# EAGLE design Cypher - V0.3 (EAGLE 9.0.1)
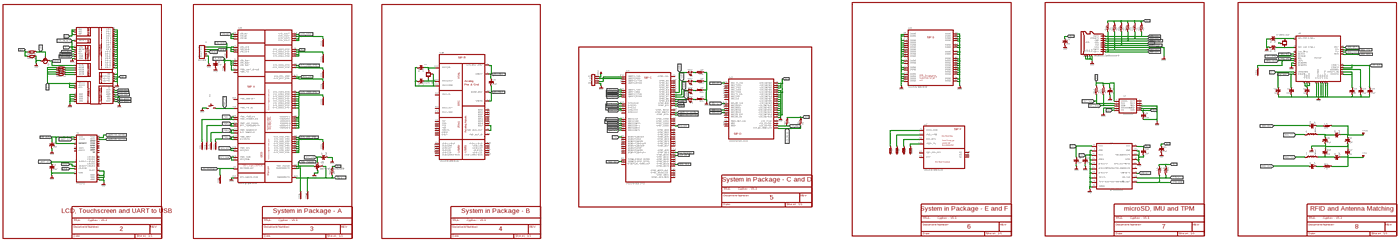
[diagram p0: schematic, sheet 1, overview]
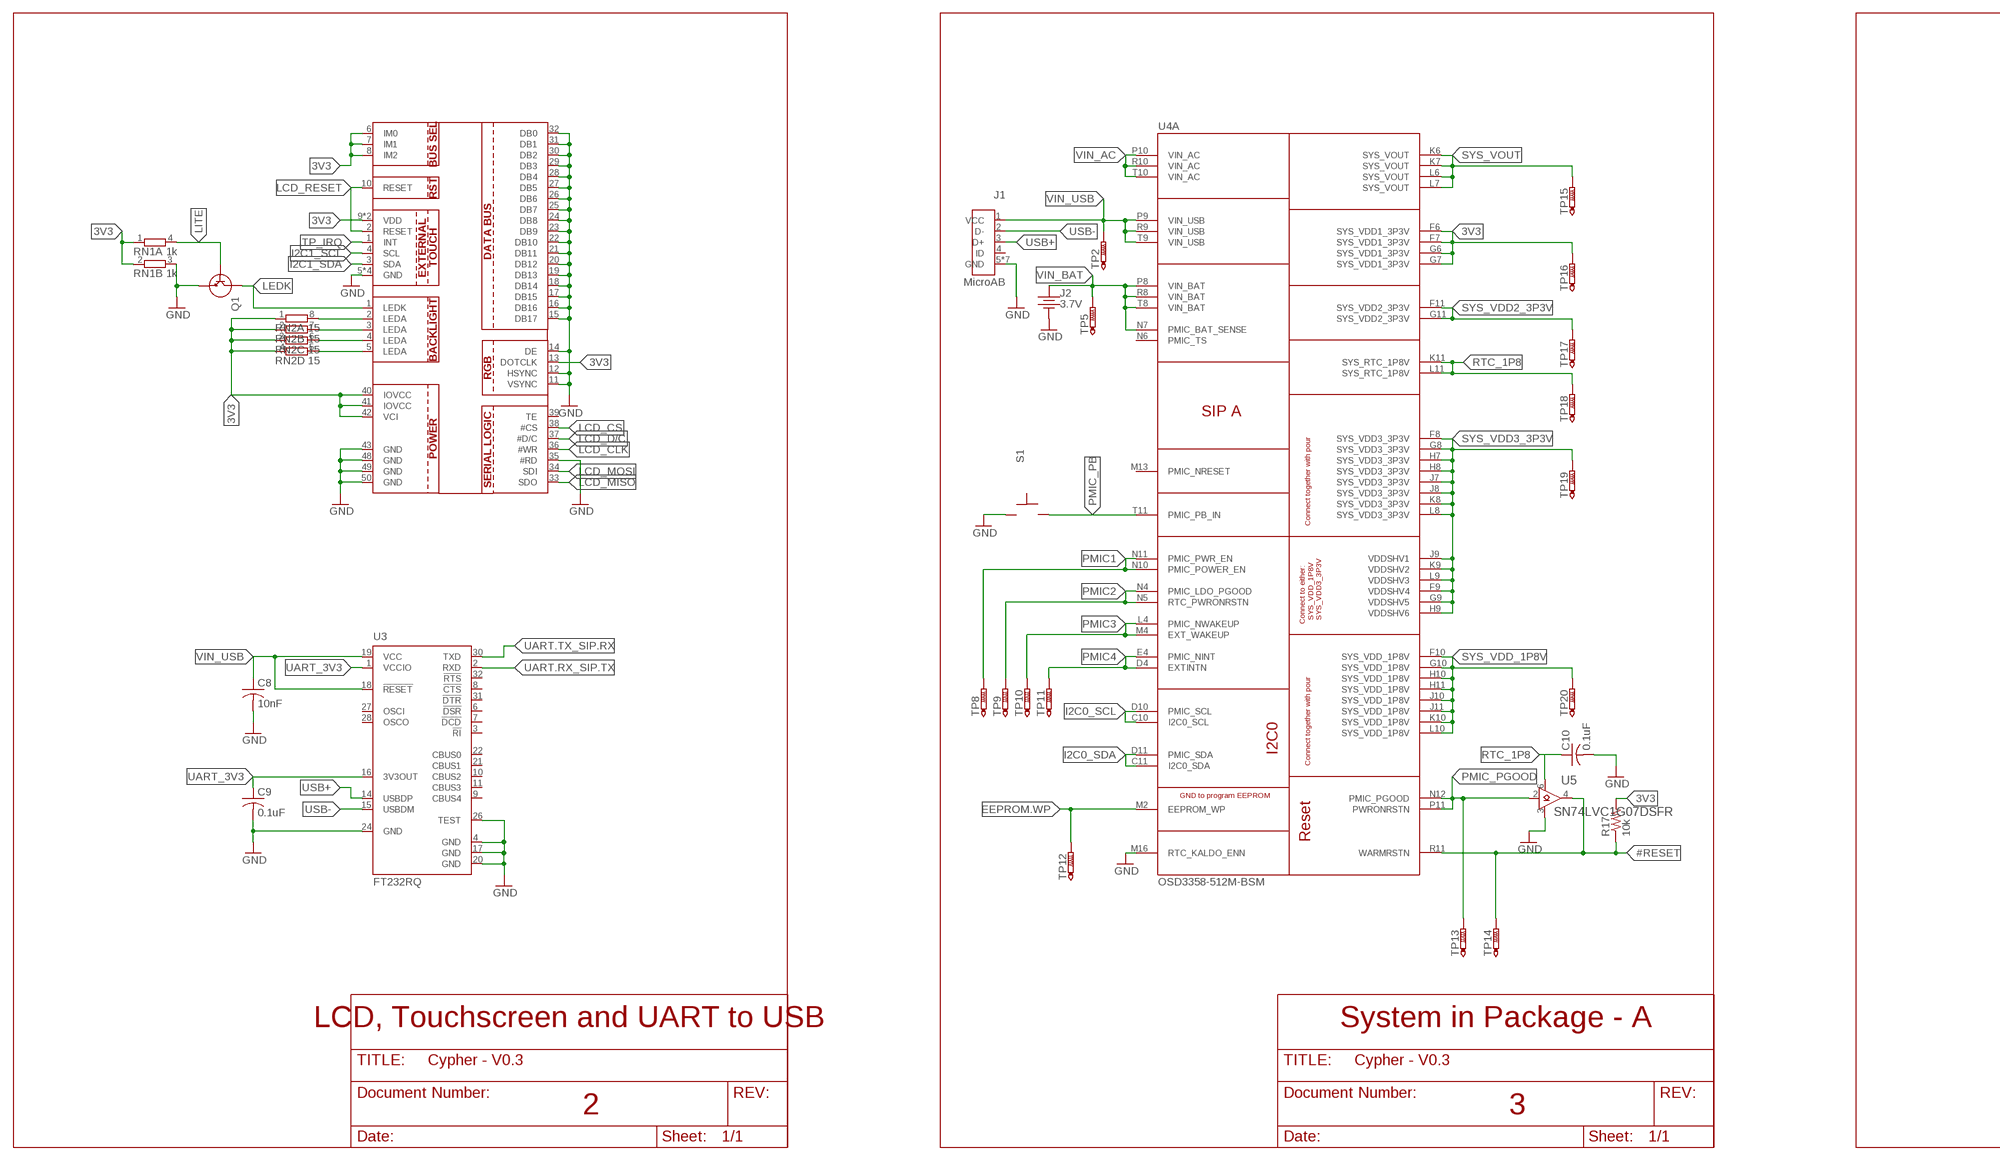
[diagram p1: schematic, sheet 1, part 1 of 4]
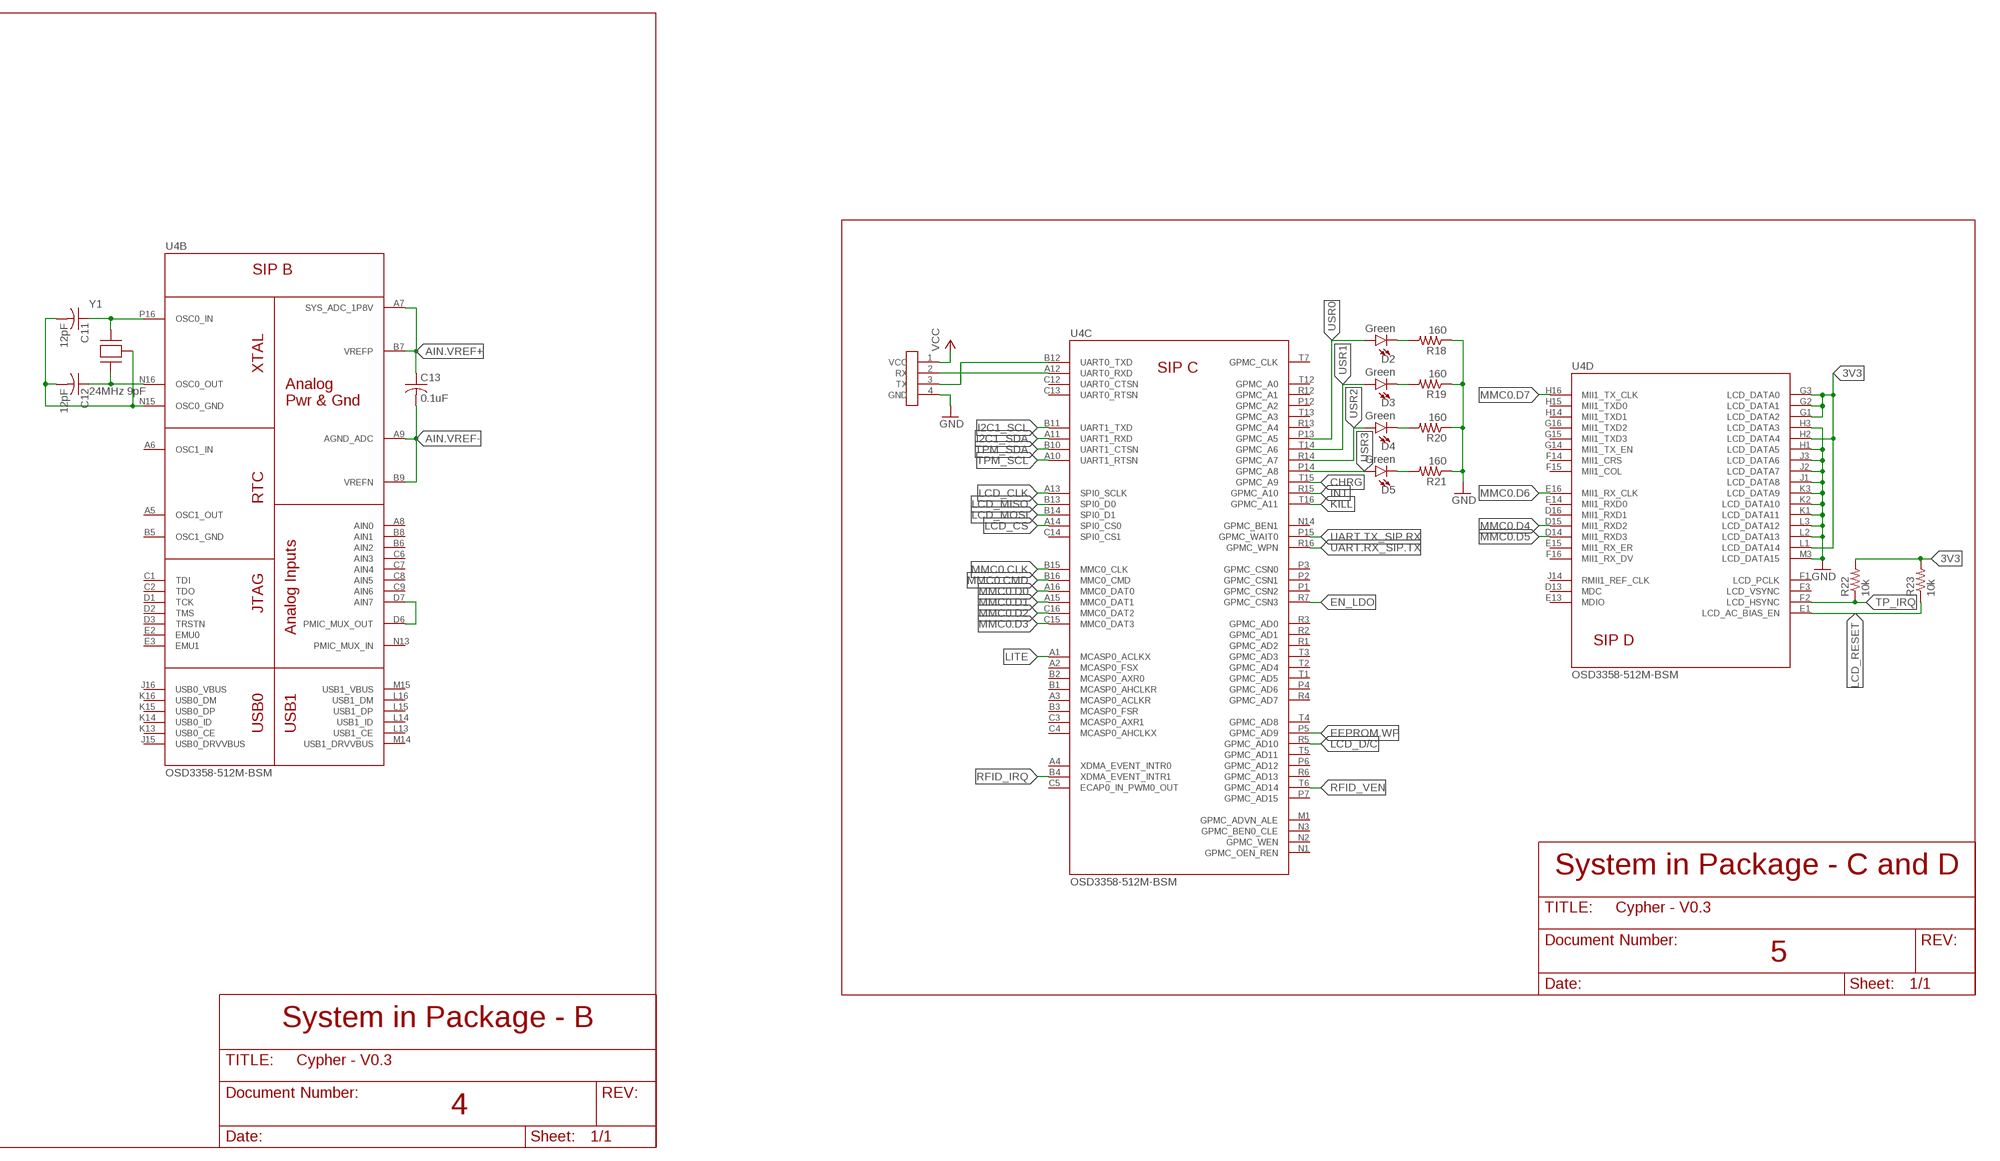
[diagram p2: schematic, sheet 1, part 2 of 4]
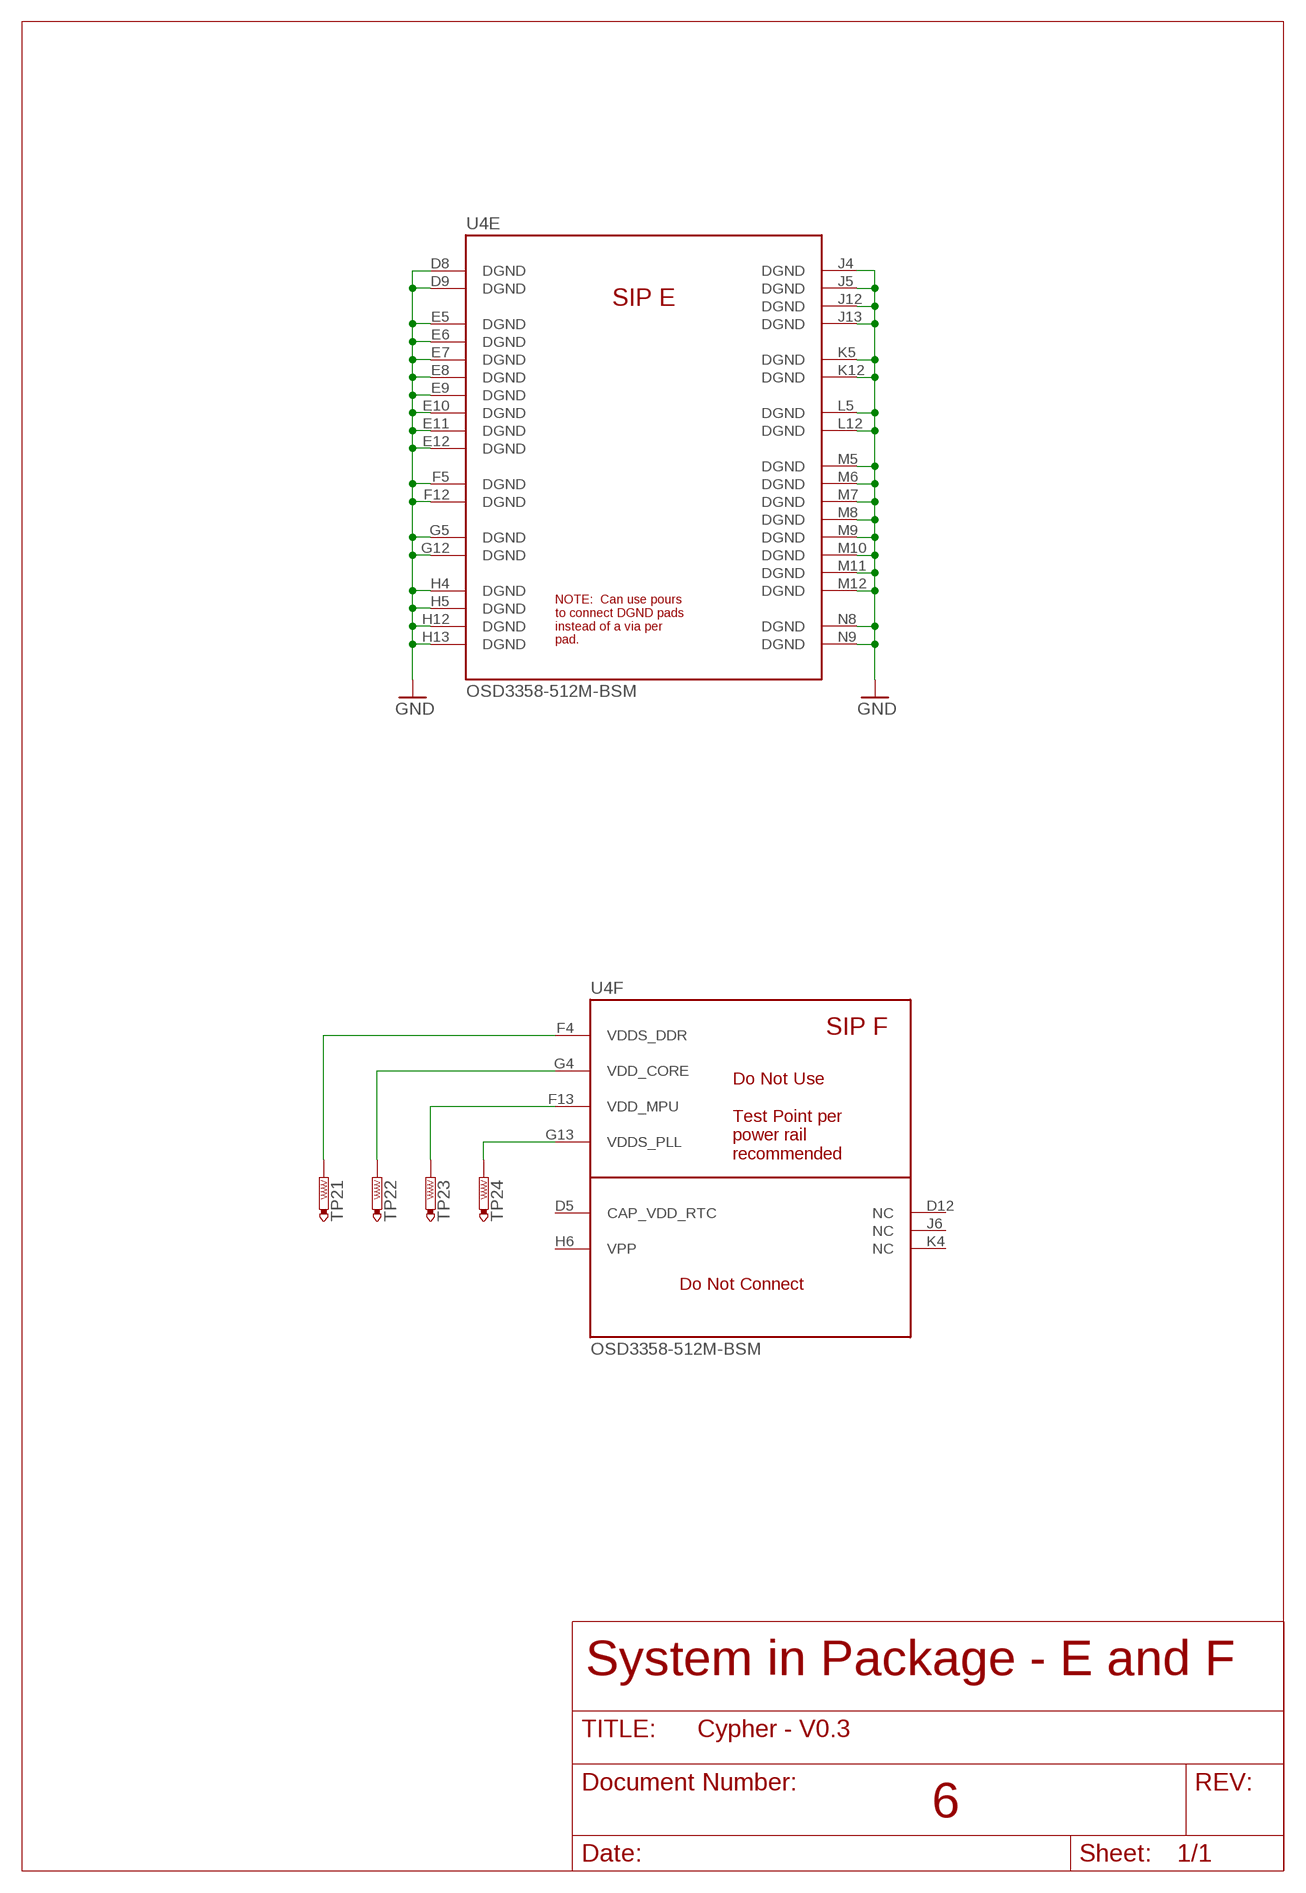
[diagram p3: schematic, sheet 1, part 3 of 4]
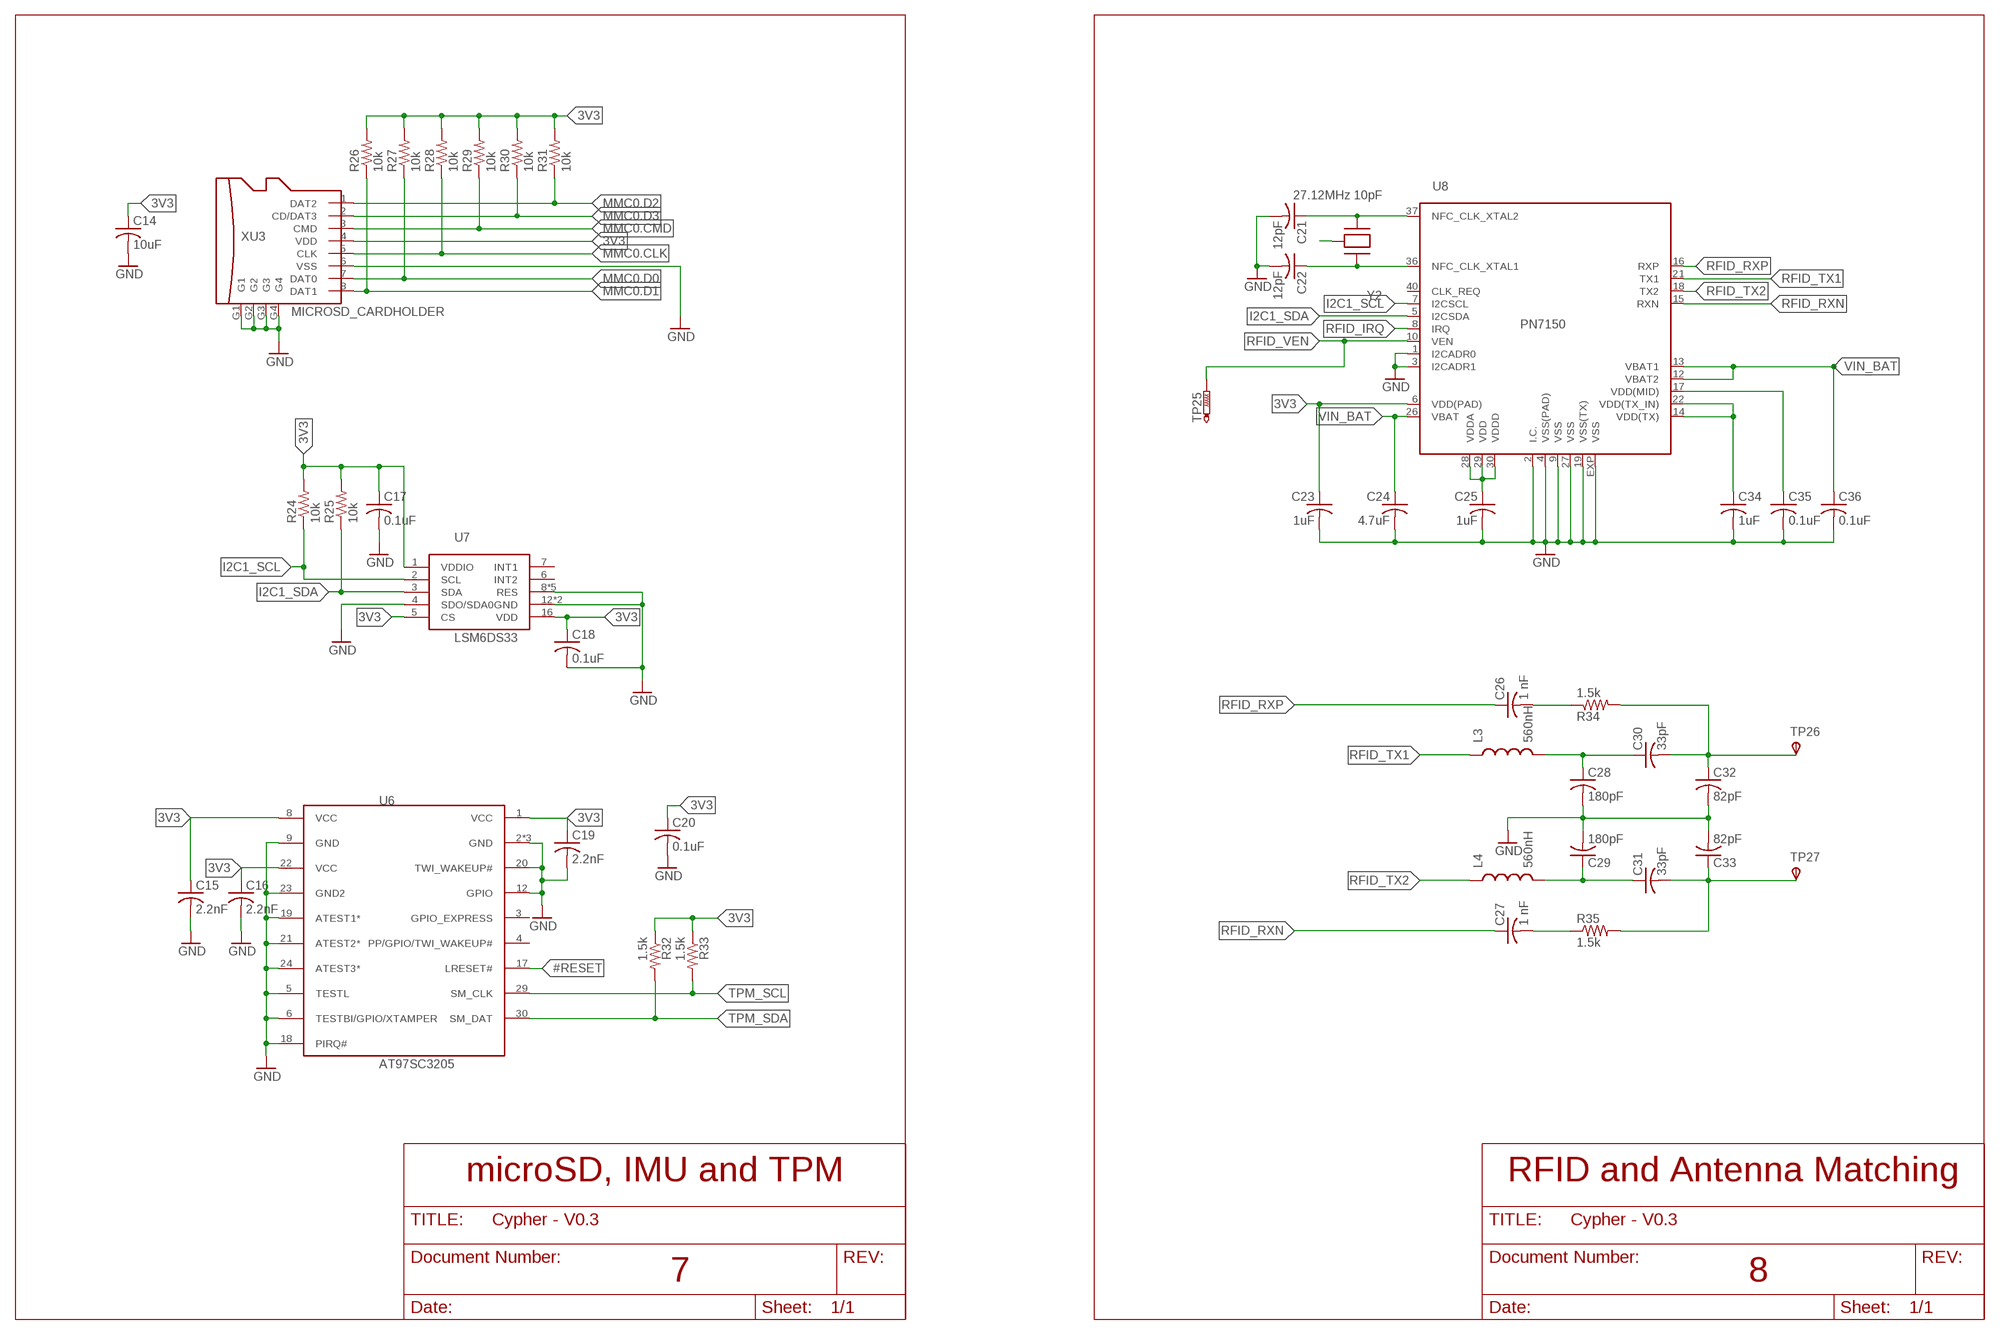
[diagram p4: schematic, sheet 1, part 4 of 4]

## Parts
C8  10nF  C-USC0402  [C0402]
C9  0.1uF  C-USC0402  [C0402]
C10  0.1uF  C-USC0402  [C0402]
C11  12pF  C-USC0402  [C0402]
C12  12pF  C-USC0402  [C0402]
C13  0.1uF  C-USC0402  [C0402]
C14  10uF  C-USC0402  [C0402]
C15  2.2nF  C-USC0402  [C0402]
C16  2.2nF  C-USC0402  [C0402]
C17  0.1uF  C-USC0402  [C0402]
C18  0.1uF  C-USC0402  [C0402]
C19  2.2nF  C-USC0402  [C0402]
C20  0.1uF  C-USC0402  [C0402]
C21  12pF  C-USC0402  [C0402]
C22  12pF  C-USC0402  [C0402]
C23  1uF  C-USC0402  [C0402]
C24  4.7uF  C-USC0402  [C0402]
C25  1uF  C-USC0402  [C0402]
C26  1 nF  C-USC0603  [C0603]
C27  1 nF  C-USC0603  [C0603]
C28  180pF  C-USC0402  [C0402]
C29  180pF  C-USC0402  [C0402]
C30  33pF  C-USC0402  [C0402]
C31  33pF  C-USC0402  [C0402]
C32  82pF  C-USC0402  [C0402]
C33  82pF  C-USC0402  [C0402]
C34  1uF  C-USC0402  [C0402]
C35  0.1uF  C-USC0402  [C0402]
C36  0.1uF  C-USC0402  [C0402]
D2  Green  LED0603  [LED-0603]
D3  Green  LED0603  [LED-0603]
D4  Green  LED0603  [LED-0603]
D5  Green  LED0603  [LED-0603]
J1  MicroAB  MICRO_USB_AB_SMD  [MICRO-USB-AB-SMD]
J2  3.7V  SH-CONNECTOR  [SH_CONNECTOR]
J3  UARTPINSSH  [SM04B-SRSS-TB]
L3  560nH  INDUCTOR0402  [C0402]
L4  560nH  INDUCTOR0402  [C0402]
Q1  MMBT2222ASOT23  [SOT-23-3]
R17  10k  R-US_R0402  [R0402]
R18  160  R-US_R0402  [R0402]
R19  160  R-US_R0402  [R0402]
R20  160  R-US_R0402  [R0402]
R21  160  R-US_R0402  [R0402]
R22  10k  R-US_R0402  [R0402]
R23  10k  R-US_R0402  [R0402]
R24  10k  R-US_R0402  [R0402]
R25  10k  R-US_R0402  [R0402]
R26  10k  R-US_R0402  [R0402]
R27  10k  R-US_R0402  [R0402]
R28  10k  R-US_R0402  [R0402]
R29  10k  R-US_R0402  [R0402]
R30  10k  R-US_R0402  [R0402]
R31  10k  R-US_R0402  [R0402]
R32  1.5k  R-US_R0402  [R0402]
R33  1.5k  R-US_R0402  [R0402]
R34  1.5k  R-US_R0402  [R0402]
R35  1.5k  R-US_R0402  [R0402]
RN1  1k  2R-NEXBV4V  [EXBV4V]
RN2  15  4R-NEXBN8V  [EXBN8V]
S1  PUSHBUTTON1.2  [EVQ-PUK]
TP2  PTR1B1,27  [B1,27]
TP5  PTR1B1,27  [B1,27]
TP8  PTR1B1,27  [B1,27]
TP9  PTR1B1,27  [B1,27]
TP10  PTR1B1,27  [B1,27]
TP11  PTR1B1,27  [B1,27]
TP12  PTR1B1,27  [B1,27]
TP13  PTR1B1,27  [B1,27]
TP14  PTR1B1,27  [B1,27]
TP15  PTR1B1,27  [B1,27]
TP16  PTR1B1,27  [B1,27]
TP17  PTR1B1,27  [B1,27]
TP18  PTR1B1,27  [B1,27]
TP19  PTR1B1,27  [B1,27]
TP20  PTR1B1,27  [B1,27]
TP21  PTR1B1,27  [B1,27]
TP22  PTR1B1,27  [B1,27]
TP23  PTR1B1,27  [B1,27]
TP24  PTR1B1,27  [B1,27]
TP25  PTR1B1,27  [B1,27]
TP26  TPSB2,54  [B2,54]
TP27  TPSB2,54  [B2,54]
U3  FT232RQ  [QFN32]
U4  OSD3358-512M-BSM  [OSD335X-BGA-256]
U5  SN74LVC1G07DSFR  [SON35P100X100X40-6N]
U6  AT97SC3205  [QFN32-4MM]
U7  LSM6DS33  [LGA-16]
U8  PN7150  [HVQFN40]
XU1  CAPTOUCHSCREEN_6PINFPC10PIN  [DF37NB-10DS-0.4V]
XU2  ILI9388_50PIN_SOCKET  [FPC/FFC_50PIN_0.5MMPITCH]
XU3  MICROSD_CARDHOLDER  [HINGED_LID_MICROSD]
Y1  24MHz 9pF  TSX-3225  [4-SMD]
Y2  27.12MHz 10pF  CRISTAL_XRCGB  [XRCGB]

## Nets
3V3: C14.1 C15.1 C16.1 C17.1 C18.1 C19.1 C20.1 C23.1 R17.2 R22.2 R23.2 R24.2 R25.2 R26.2 R27.2 R28.2 R29.2 R30.2 R31.2 R32.1 R33.1 RN1.1 RN1.2 RN2.1 RN2.2 RN2.3 RN2.4 TP16.TP U4.F6(A:SYS_VDD1_3P3V) U4.F7(A:SYS_VDD1_3P3V) U4.G1(D:LCD_DATA2) U4.G2(D:LCD_DATA1) U4.G3(D:LCD_DATA0) U4.G6(A:SYS_VDD1_3P3V) U4.G7(A:SYS_VDD1_3P3V) U4.H2(D:LCD_DATA4) U4.L1(D:LCD_DATA14) U6.1(VCC) U6.8(VCC) U6.22(VCC) U7.1(VDDIO) U7.5(CS) U7.16(VDD) U8.6(VDD(PAD)) XU1.9(VDD) XU1.10(VDD) XU2.6(IM0) XU2.7(IM1) XU2.8(IM2) XU2.13(DOTCLK) XU2.40(IOVCC) XU2.41(IOVCC) XU2.42(VCI) XU3.4(VDD)
#RESET: R17.1 TP14.TP U4.R11(A:WARMRSTN) U5.4(Y) U6.17(LRESET#)
AIN.VREF+: C13.1 U4.A7(B:SYS_ADC_1P8V) U4.B7(B:VREFP)
AIN.VREF-: C13.2 U4.A9(B:AGND_ADC) U4.B9(B:VREFN)
ANT_1: C30.2 C32.1 R34.2 TP26.TP(PP)
ANT_2: C31.2 C33.1 R35.2 TP27.TP(PP)
CHRG: U4.T15(C:GPMC_A9)
D2_CAT: D2.C R18.2
D3_CAT: D3.C R19.2
D4_CAT: D4.C R20.2
D5_CAT: D5.C R21.2
EEPROM.WP: TP12.TP U4.M2(A:EEPROM_WP) U4.P5(C:GPMC_AD9)
EMCF_ANTM1: C28.1 C30.1 L3.2
EMCF_ANTM2: C29.1 C31.1 L4.2
EN_LDO: U4.R7(C:GPMC_CSN3)
GND: C8.2 C9.2 C10.2 C14.2 C15.2 C16.2 C17.2 C18.2 C19.2 C20.2 C21.2 C22.2 C23.2 C24.2 C25.2 C28.2 C29.2 C32.2 C33.2 C34.2 C35.2 C36.2 J1.5(GND) J1.PAD1(GND) J1.PAD2(GND) J1.PAD3(GND) J1.PAD4(GND) J1.PAD5(GND) J1.PAD6(GND) J2.1(V-) J3.4(GND) Q1.E R18.1 R19.1 R20.1 R21.1 RN1.3 S1.2 S1.4 U3.4(GND) U3.17(GND) U3.20(GND) U3.24(GND) U3.26(TEST) U4.D8(E:DGND) U4.D9(E:DGND) U4.E5(E:DGND) U4.E6(E:DGND) U4.E7(E:DGND) U4.E8(E:DGND) U4.E9(E:DGND) U4.E10(E:DGND) U4.E11(E:DGND) U4.E12(E:DGND) U4.F5(E:DGND) U4.F12(E:DGND) U4.G5(E:DGND) U4.G12(E:DGND) U4.H1(D:LCD_DATA5) U4.H3(D:LCD_DATA3) U4.H4(E:DGND) U4.H5(E:DGND) U4.H12(E:DGND) U4.H13(E:DGND) U4.J1(D:LCD_DATA8) U4.J2(D:LCD_DATA7) U4.J3(D:LCD_DATA6) U4.J4(E:DGND) U4.J5(E:DGND) U4.J12(E:DGND) U4.J13(E:DGND) U4.K1(D:LCD_DATA11) U4.K2(D:LCD_DATA10) U4.K3(D:LCD_DATA9) U4.K5(E:DGND) U4.K12(E:DGND) U4.L2(D:LCD_DATA13) U4.L3(D:LCD_DATA12) U4.L5(E:DGND) U4.L12(E:DGND) U4.M3(D:LCD_DATA15) U4.M5(E:DGND) U4.M6(E:DGND) U4.M7(E:DGND) U4.M8(E:DGND) U4.M9(E:DGND) U4.M10(E:DGND) U4.M11(E:DGND) U4.M12(E:DGND) U4.M16(A:RTC_KALDO_ENN) U4.N8(E:DGND) U4.N9(E:DGND) U5.3(GND) U6.2(GND) U6.5(TESTL) U6.6(TESTBI/GPIO/XTAMPER) U6.9(GND) U6.12(GPIO) U6.18(PIRQ#) U6.19(ATEST1*) U6.20(TWI_WAKEUP#) U6.21(ATEST2*) U6.23(GND2) U6.24(ATEST3*) U6.32(GND) U6.EXP(GND) U7.4(SDO/SDA0) U7.8(RES) U7.9(RES) U7.10(RES) U7.11(RES) U7.12(GND) U7.13(GND) U7.15(RES) U8.1(I2CADR0) U8.2(I.C.) U8.3(I2CADR1) U8.4(VSS(PAD)) U8.9(VSS) U8.19(VSS(TX)) U8.27(VSS) U8.EXP(VSS) XU1.5(GND) XU1.6(GND) XU1.7(GND) XU1.8(GND) XU2.11(VSYNC) XU2.12(HSYNC) XU2.14(DE) XU2.15(DB17) XU2.16(DB16) XU2.17(DB15) XU2.18(DB14) XU2.19(DB13) XU2.20(DB12) XU2.21(DB11) XU2.22(DB10) XU2.23(DB9) XU2.24(DB8) XU2.25(DB7) XU2.26(DB6) XU2.27(DB5) XU2.28(DB4) XU2.29(DB3) XU2.30(DB2) XU2.31(DB1) XU2.32(DB0) XU2.35(#RD) XU2.43(GND) XU2.48(GND) XU2.49(GND) XU2.50(GND) XU3.6(VSS) XU3.G1 XU3.G2 XU3.G3 XU3.G4
I2C0_SCL: U4.C10(A:I2C0_SCL) U4.D10(A:PMIC_SCL)
I2C0_SDA: U4.C11(A:I2C0_SDA) U4.D11(A:PMIC_SDA)
I2C1_SCL: R24.1 U4.B11(C:UART1_TXD) U7.2(SCL) U8.7(I2CSCL) XU1.4(SCL)
I2C1_SDA: R25.1 U4.A11(C:UART1_RXD) U7.3(SDA) U8.5(I2CSDA) XU1.3(SDA)
INT: U4.R15(C:GPMC_A10)
KILL: U4.T16(C:GPMC_A11)
LCD_CLK: U4.A13(C:SPI0_SCLK) XU2.36(#WR)
LCD_CS: U4.A14(C:SPI0_CS0) XU2.38(#CS)
LCD_D/C: U4.R5(C:GPMC_AD10) XU2.37(#D/C)
LCD_MISO: U4.B13(C:SPI0_D0) XU2.33(SDO)
LCD_MOSI: U4.B14(C:SPI0_D1) XU2.34(SDI)
LCD_RESET: R23.1 U4.E1(D:LCD_AC_BIAS_EN) XU1.2(RESET) XU2.10(RESET)
LEDA@2: RN2.8 XU2.2(LEDA)
LEDA@3: RN2.7 XU2.3(LEDA)
LEDA@4: RN2.6 XU2.4(LEDA)
LEDA@5: RN2.5 XU2.5(LEDA)
LEDK: Q1.C XU2.1(LEDK)
LITE: Q1.B RN1.4 U4.A1(C:MCASP0_ACLKX)
MMC0.CLK: R28.1 U4.B15(C:MMC0_CLK) XU3.5(CLK)
MMC0.CMD: R29.1 U4.B16(C:MMC0_CMD) XU3.3(CMD)
MMC0.D0: R27.1 U4.A16(C:MMC0_DAT0) XU3.7(DAT0)
MMC0.D1: R26.1 U4.A15(C:MMC0_DAT1) XU3.8(DAT1)
MMC0.D2: R31.1 U4.C16(C:MMC0_DAT2) XU3.1(DAT2)
MMC0.D3: R30.1 U4.C15(C:MMC0_DAT3) XU3.2(CD/DAT3)
MMC0.D4: U4.D15(D:MII1_RXD2)
MMC0.D5: U4.D14(D:MII1_RXD3)
MMC0.D6: U4.E16(D:MII1_RX_CLK)
MMC0.D7: U4.H16(D:MII1_TX_CLK)
N$1: U4.D6(B:PMIC_MUX_OUT) U4.D7(B:AIN7)
NC: Y2.2(GND) Y2.4(GND)
OSC_GND: C11.2 C12.2 U4.N15(B:OSC0_GND) Y1.2(GND) Y1.4(GND)
PMIC1: TP8.TP U4.N10(A:PMIC_POWER_EN) U4.N11(A:PMIC_PWR_EN)
PMIC2: TP9.TP U4.N4(A:PMIC_LDO_PGOOD) U4.N5(A:RTC_PWRONRSTN)
PMIC3: TP10.TP U4.L4(A:PMIC_NWAKEUP) U4.M4(A:EXT_WAKEUP)
PMIC4: TP11.TP U4.D4(A:EXTINTN) U4.E4(A:PMIC_NINT)
PMIC_PB: S1.1 S1.3 U4.T11(A:PMIC_PB_IN)
PMIC_PGOOD: TP13.TP U4.N12(A:PMIC_PGOOD) U4.P11(A:PWRONRSTN) U5.2(A)
RFID_IRQ: U4.B4(C:XDMA_EVENT_INTR1) U8.8(IRQ)
RFID_MISC_1: C26.2 R34.1
RFID_MISC_2: C27.2 R35.1
RFID_OSC_IN: C22.1 U8.36(NFC_CLK_XTAL1) Y2.1(OSC_IN)
RFID_OSC_OUT: C21.1 U8.37(NFC_CLK_XTAL2) Y2.3(OSC_OUT)
RFID_RXN: C27.1 U8.15(RXN)
RFID_RXP: C26.1 U8.16(RXP)
RFID_TX1: L3.1 U8.21(TX1)
RFID_TX2: L4.1 U8.18(TX2)
RFID_VEN: TP25.TP U4.T6(C:GPMC_AD14) U8.10(VEN)
RTC_1P8: C10.1 TP18.TP U4.K11(A:SYS_RTC_1P8V) U4.L11(A:SYS_RTC_1P8V) U5.6(VCC)
SIP_OSC_IN: C11.1 U4.P16(B:OSC0_IN) Y1.1(OSC_IN)
SIP_OSC_OUT: C12.1 U4.N16(B:OSC0_OUT) Y1.3(OSC_OUT)
SYS_VDD2_3P3V: TP17.TP U4.F11(A:SYS_VDD2_3P3V) U4.G11(A:SYS_VDD2_3P3V)
SYS_VDD3_3P3V: TP19.TP U4.F8(A:SYS_VDD3_3P3V) U4.F9(A:VDDSHV4) U4.G8(A:SYS_VDD3_3P3V) U4.G9(A:VDDSHV5) U4.H7(A:SYS_VDD3_3P3V) U4.H8(A:SYS_VDD3_3P3V) U4.H9(A:VDDSHV6) U4.J7(A:SYS_VDD3_3P3V) U4.J8(A:SYS_VDD3_3P3V) U4.J9(A:VDDSHV1) U4.K8(A:SYS_VDD3_3P3V) U4.K9(A:VDDSHV2) U4.L8(A:SYS_VDD3_3P3V) U4.L9(A:VDDSHV3)
SYS_VDD_1P8V: TP20.TP U4.F10(A:SYS_VDD_1P8V) U4.G10(A:SYS_VDD_1P8V) U4.H10(A:SYS_VDD_1P8V) U4.H11(A:SYS_VDD_1P8V) U4.J10(A:SYS_VDD_1P8V) U4.J11(A:SYS_VDD_1P8V) U4.K10(A:SYS_VDD_1P8V) U4.L10(A:SYS_VDD_1P8V)
SYS_VOUT: TP15.TP U4.K6(A:SYS_VOUT) U4.K7(A:SYS_VOUT) U4.L6(A:SYS_VOUT) U4.L7(A:SYS_VOUT)
TP_IRQ: R22.1 U4.F2(D:LCD_HSYNC) XU1.1(INT)
TPM_SCL: R33.2 U4.A10(C:UART1_RTSN) U6.29(SM_CLK)
TPM_SDA: R32.2 U4.B10(C:UART1_CTSN) U6.30(SM_DAT)
UART0_RX: J3.2(RX) U4.A12(C:UART0_RXD)
UART0_TX: J3.3(TX) U4.B12(C:UART0_TXD)
UART.RX_SIP.TX: U3.2(RXD) U4.R16(C:GPMC_WPN)
UART.TX_SIP.RX: U3.30(TXD) U4.P15(C:GPMC_WAIT0)
UART_3V3: C9.1 U3.1(VCCIO) U3.16(3V3OUT)
USB+: J1.3(D+) U3.14(USBDP)
USB-: J1.2(D-) U3.15(USBDM)
USR0: D2.A U4.P13(C:GPMC_A5)
USR1: D3.A U4.T14(C:GPMC_A6)
USR2: D4.A U4.R14(C:GPMC_A7)
USR3: D5.A U4.P14(C:GPMC_A8)
VCC: J3.1(VCC)
VDD: C25.1 U8.28(VDDA) U8.29(VDD) U8.30(VDDD)
VDD(MID): C35.1 U8.17(VDD(MID))
VDD(TX): C34.1 U8.14(VDD(TX)) U8.22(VDD(TX_IN))
VDD_CORE: TP22.TP U4.G4(F:VDD_CORE)
VDD_MPU: TP23.TP U4.F13(F:VDD_MPU)
VDDS_DDR: TP21.TP U4.F4(F:VDDS_DDR)
VDDS_PLL: TP24.TP U4.G13(F:VDDS_PLL)
VIN_AC: U4.P10(A:VIN_AC) U4.R10(A:VIN_AC) U4.T10(A:VIN_AC)
VIN_BAT: C24.1 C36.1 J2.2(V+) TP5.TP U4.N7(A:PMIC_BAT_SENSE) U4.P8(A:VIN_BAT) U4.R8(A:VIN_BAT) U4.T8(A:VIN_BAT) U8.12(VBAT2) U8.13(VBAT1) U8.26(VBAT)
VIN_USB: C8.1 J1.1(VCC) TP2.TP U3.18(!RESET) U3.19(VCC) U4.P9(A:VIN_USB) U4.R9(A:VIN_USB) U4.T9(A:VIN_USB)
Unconnected: J1.4(ID) U3.3(!RI) U3.6(!DSR) U3.7(!DCD) U3.8(!CTS) U3.9(CBUS4) U3.10(CBUS2) U3.11(CBUS3) U3.21(CBUS1) U3.22(CBUS0) U3.27(OSCI) U3.28(OSCO) U3.31(!DTR) U3.32(!RTS) U4.A2(C:MCASP0_FSX) U4.A3(C:MCASP0_ACLKR) U4.A4(C:XDMA_EVENT_INTR0) U4.A5(B:OSC1_OUT) U4.A6(B:OSC1_IN) U4.A8(B:AIN0) U4.B1(C:MCASP0_AHCLKR) U4.B2(C:MCASP0_AXR0) U4.B3(C:MCASP0_FSR) U4.B5(B:OSC1_GND) U4.B6(B:AIN2) U4.B8(B:AIN1) U4.C1(B:TDI) U4.C2(B:TDO) U4.C3(C:MCASP0_AXR1) U4.C4(C:MCASP0_AHCLKX) U4.C5(C:ECAP0_IN_PWM0_OUT) U4.C6(B:AIN3) U4.C7(B:AIN4) U4.C8(B:AIN5) U4.C9(B:AIN6) U4.C12(C:UART0_CTSN) U4.C13(C:UART0_RTSN) U4.C14(C:SPI0_CS1) U4.D1(B:TCK) U4.D2(B:TMS) U4.D3(B:TRSTN) U4.D5(F:CAP_VDD_RTC) U4.D12(F:NC) U4.D13(D:MDC) U4.D16(D:MII1_RXD1) U4.E2(B:EMU0) U4.E3(B:EMU1) U4.E13(D:MDIO) U4.E14(D:MII1_RXD0) U4.E15(D:MII1_RX_ER) U4.F1(D:LCD_PCLK) U4.F3(D:LCD_VSYNC) U4.F14(D:MII1_CRS) U4.F15(D:MII1_COL) U4.F16(D:MII1_RX_DV) U4.G14(D:MII1_TX_EN) U4.G15(D:MII1_TXD3) U4.G16(D:MII1_TXD2) U4.H6(F:VPP) U4.H14(D:MII1_TXD1) U4.H15(D:MII1_TXD0) U4.J6(F:NC) U4.J14(D:RMII1_REF_CLK) U4.J15(B:USB0_DRVVBUS) U4.J16(B:USB0_VBUS) U4.K4(F:NC) U4.K13(B:USB0_CE) U4.K14(B:USB0_ID) U4.K15(B:USB0_DP) U4.K16(B:USB0_DM) U4.L13(B:USB1_CE) U4.L14(B:USB1_ID) U4.L15(B:USB1_DP) U4.L16(B:USB1_DM) U4.M1(C:GPMC_ADVN_ALE) U4.M13(A:PMIC_NRESET) U4.M14(B:USB1_DRVVBUS) U4.M15(B:USB1_VBUS) U4.N1(C:GPMC_OEN_REN) U4.N2(C:GPMC_WEN) U4.N3(C:GPMC_BEN0_CLE) U4.N6(A:PMIC_TS) U4.N13(B:PMIC_MUX_IN) U4.N14(C:GPMC_BEN1) U4.P1(C:GPMC_CSN2) U4.P2(C:GPMC_CSN1) U4.P3(C:GPMC_CSN0) U4.P4(C:GPMC_AD6) U4.P6(C:GPMC_AD12) U4.P7(C:GPMC_AD15) U4.P12(C:GPMC_A2) U4.R1(C:GPMC_AD2) U4.R2(C:GPMC_AD1) U4.R3(C:GPMC_AD0) U4.R4(C:GPMC_AD7) U4.R6(C:GPMC_AD13) U4.R12(C:GPMC_A1) U4.R13(C:GPMC_A4) U4.T1(C:GPMC_AD5) U4.T2(C:GPMC_AD4) U4.T3(C:GPMC_AD3) U4.T4(C:GPMC_AD8) U4.T5(C:GPMC_AD11) U4.T7(C:GPMC_CLK) U4.T12(C:GPMC_A0) U4.T13(C:GPMC_A3) U5.1(N.C_2) U5.5(N.C) U6.3(GPIO_EXPRESS) U6.4(PP/GPIO/TWI_WAKEUP#) U7.6(INT2) U7.7(INT1) U8.40(CLK_REQ) XU2.39(TE)

## Notes on the sheet
- System in Package - C and D
- 5
- System in Package - E and F | microSD, IMU and TPM | RFID and Antenna Matching
- LCD, Touchscreen and UART to USB | System in Package - A | System in Package - B
- 6 | 7 | 8
- 2 | 3 | 4

## Library data of the parts
C8-C36 = resistor:C-US: CAPACITOR, American symbol
D2-D5 = SparkFun-LED:LED: LED (Generic) Standard schematic elements and footprints for 5mm, 3mm, 1206, and 0603 sized LEDs. Generic LEDs with no color specified.
J1 = Megahash:MICRO_USB_AB_SMD
J2 = Megahash:SH-CONNECTOR
J3 = Megahash:UARTPINS
L3 L4 = TPM:INDUCTOR: Inductors Basic Inductor/Choke - 0603 and 1206. Footprints are not proven and vary greatly between part numbers. INDUCTOR POWER 3.3UH 4.0A SMD 0.197" L x 0.197" W x 0.177" H (5.00mm x 5.00mm x 4.50mm)
Q1 = Megahash:MMBT2222A
R17-R35 = resistor:R-US_: RESISTOR, American symbol
RN1 = resistor-dil:2R-N: Array Chip Resistor Source: Panasonic; OC_FARNELL: unknown; OC_NEWARK: unknown
RN2 = resistor-dil:4R-N: Array Chip Resistor Source: RS Component / Phycomp; OC_FARNELL: unknown; OC_NEWARK: unknown
S1 = Megahash:PUSHBUTTON
TP2 TP5 TP8-TP25 = testpad:PTR1: TEST PIN
TP26 TP27 = testpad:TPS: TEST PIN
U3 = ftdichip:FT232R: Source: http://www.ftdichip.com/Documents/DataSheets/DS_FT232R_v104.pdf; MPN: FT232RQ-REEL; OC_FARNELL: 1146033; OC_NEWARK: 91K9919
U4 = Octavo-Systems:OSD3358-512M-BSM: Octavo Systems LLC OSD335x Family SiP: 21mm x 21mm, 1.27mm pitch 256 pin BGA contains AM3358, 512MB DDR3, TPS65217, TL5209, EEPROM and passives. Commerical Temperature: 0C to 85C.; MPN: BB-POCKET; OC_NEWARK: 45AC6372
U5 = Texas Instruments_By_element14_Batch_1:SN74LVC1G07DSFR: SINGLE BUFFER/DRIVER; MPN: SN74LVC1G07DSFR; OC_FARNELL: 2057110; OC_NEWARK: 64T4114; PACKAGE: SON-6; SUPPLIER: TEXAS INSTRUMENTS
U6 = Megahash:AT97SC3205: AT97SC3205 Atmel Trusted Platform Module – I2C Interface The Atmel AT97SC3205 is a fully integrated security module designed to be integrated into personal computers and other embedded systems. It implements version 1.2 of the Trusted Computing Group (TCG) specification for Trusted Platform Modules (TPM). Package: 32 pin QFN Online info: Datasheet <http://ww1.microchip.com/downloads/en/DeviceDoc/Atmel-8883S-TPM-AT97SC3205T-Datasheet-Summary.pdf> and Digikey page <https://www.digikey.com/product-detail/en/microchip-technology/AT97SC3205T-G3M4C-10/AT97SC3205T-G3M4C-10CT-ND/7796837>.
U7 = Megahash:LSM6DS33; MPN: LSM6DS33TR; OC_NEWARK: 18AC7419
U8 = Megahash:PN7150
XU1 = Megahash:CAPTOUCHSCREEN_6PINFPC
XU2 = Megahash:ILI9388_50PIN_SOCKET
XU3 = Megahash:MICROSD_CARDHOLDER
Y1 = Megahash:TSX-3225
Y2 = Megahash:CRISTAL_XRCGB

## Board
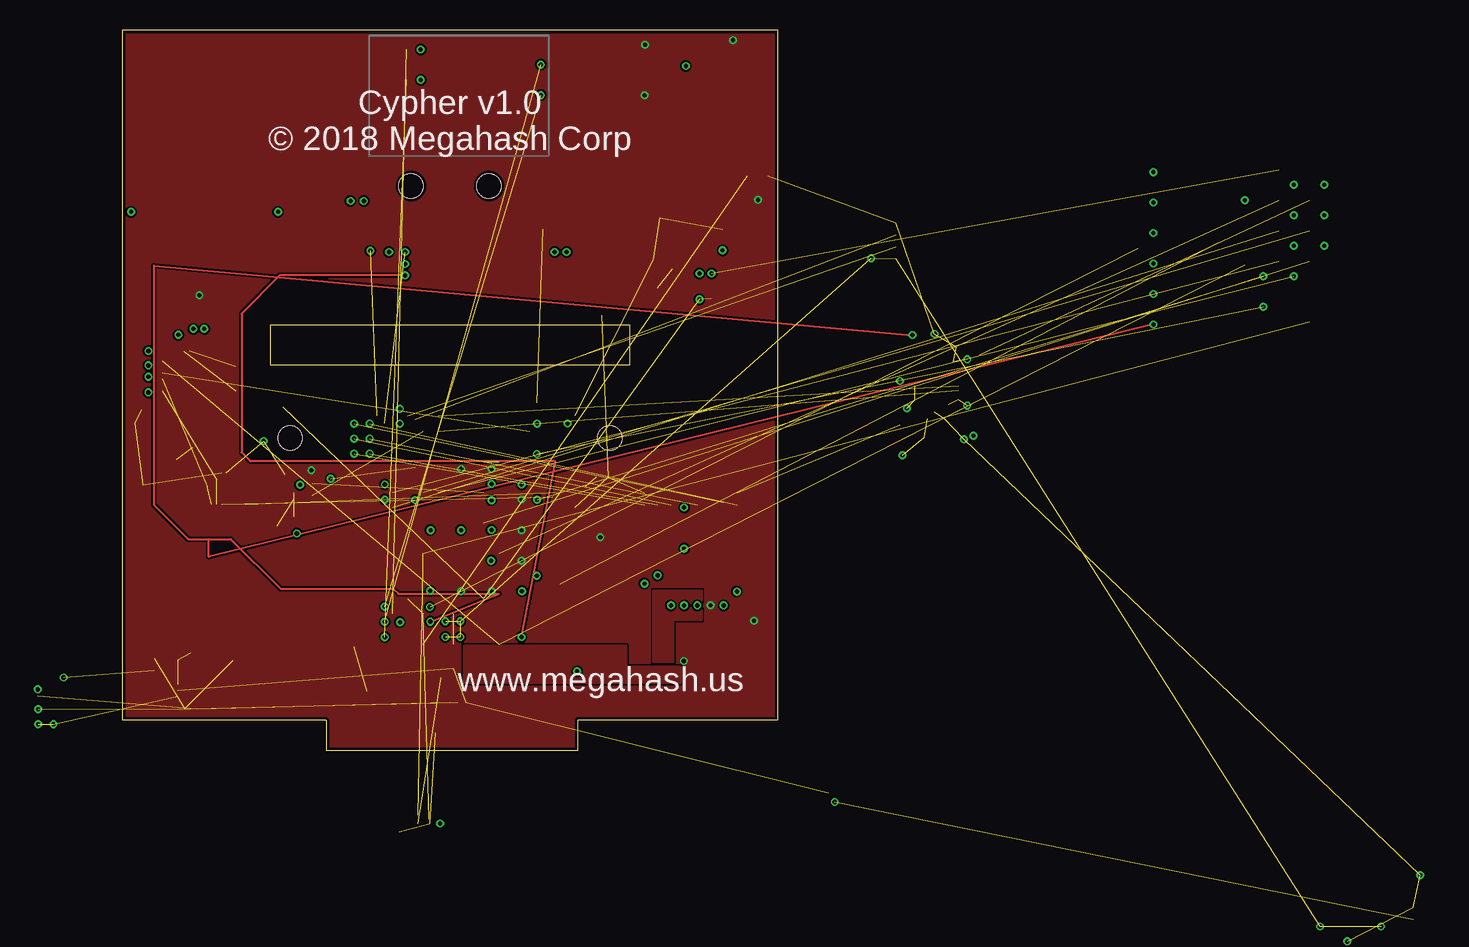
[diagram p5: board, top side]
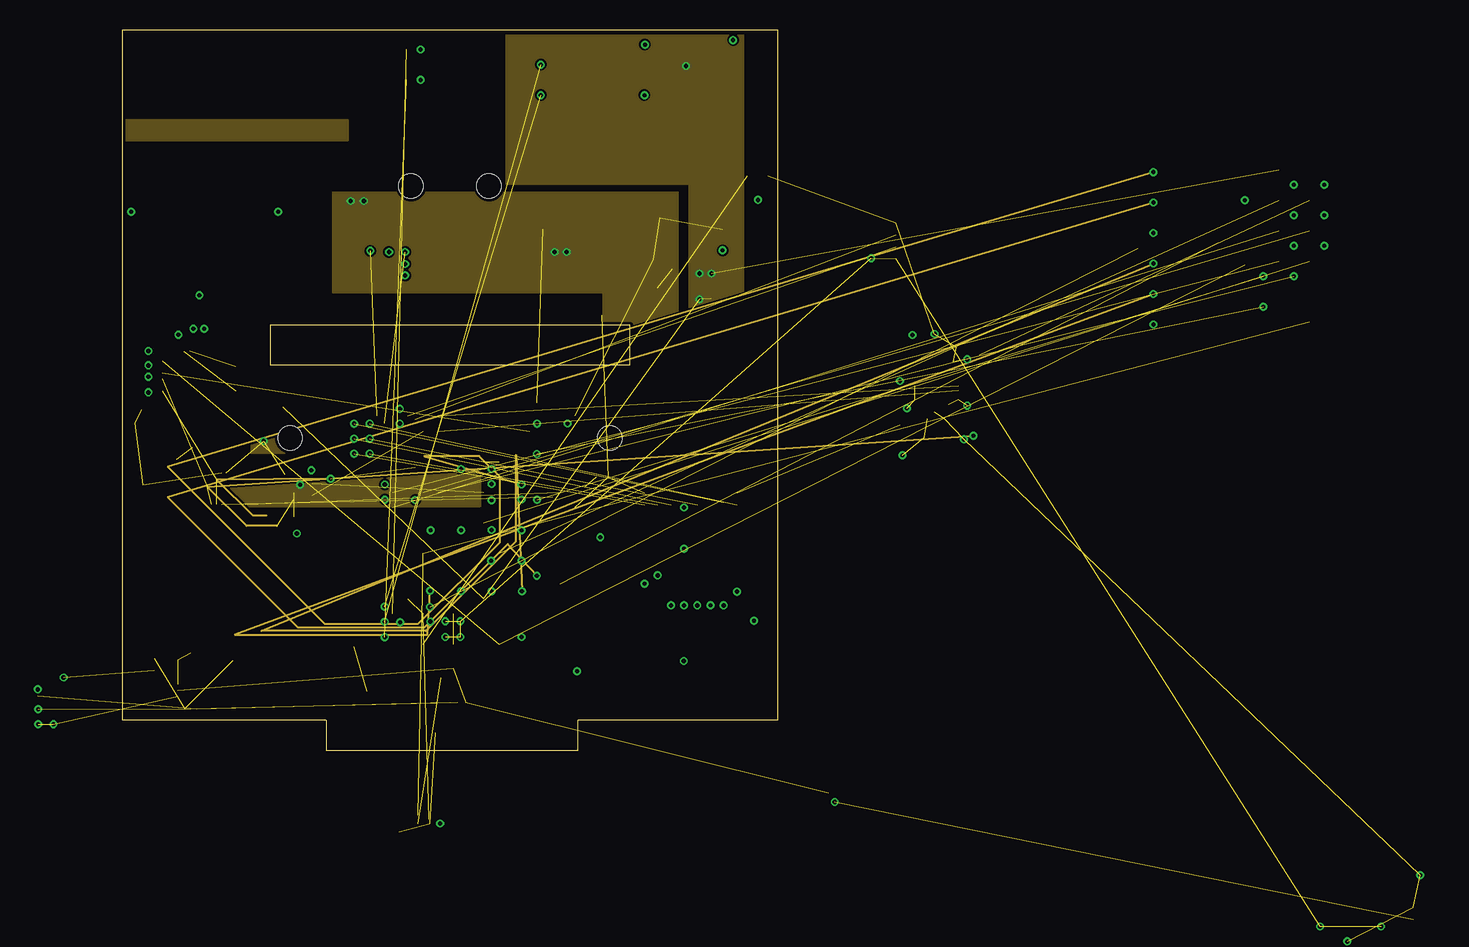
[diagram p6: board, inner layer VCC]
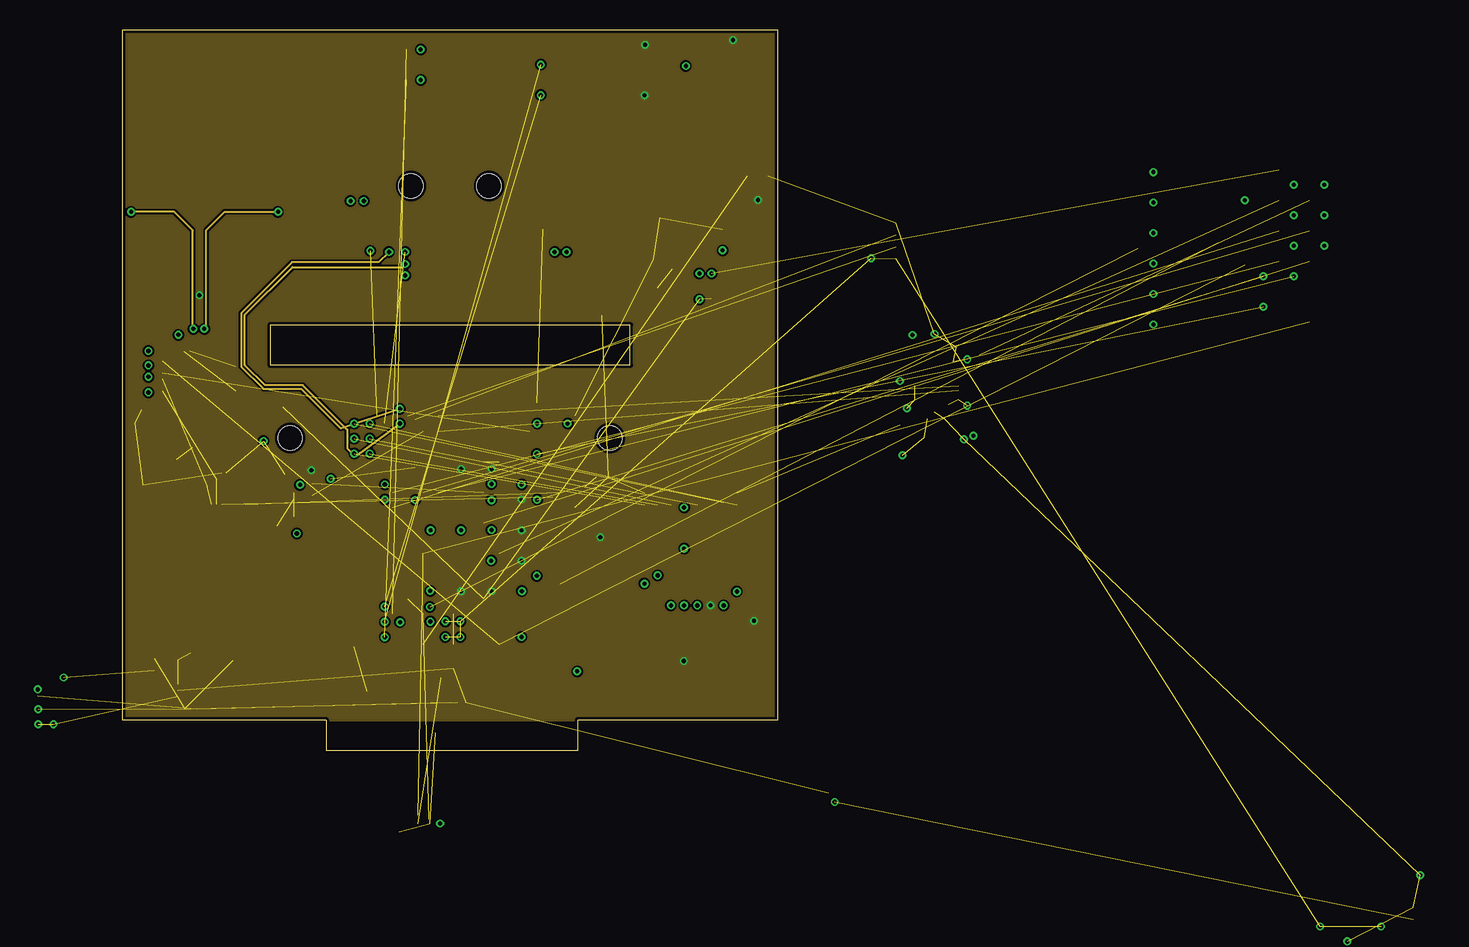
[diagram p7: board, inner layer Signal]
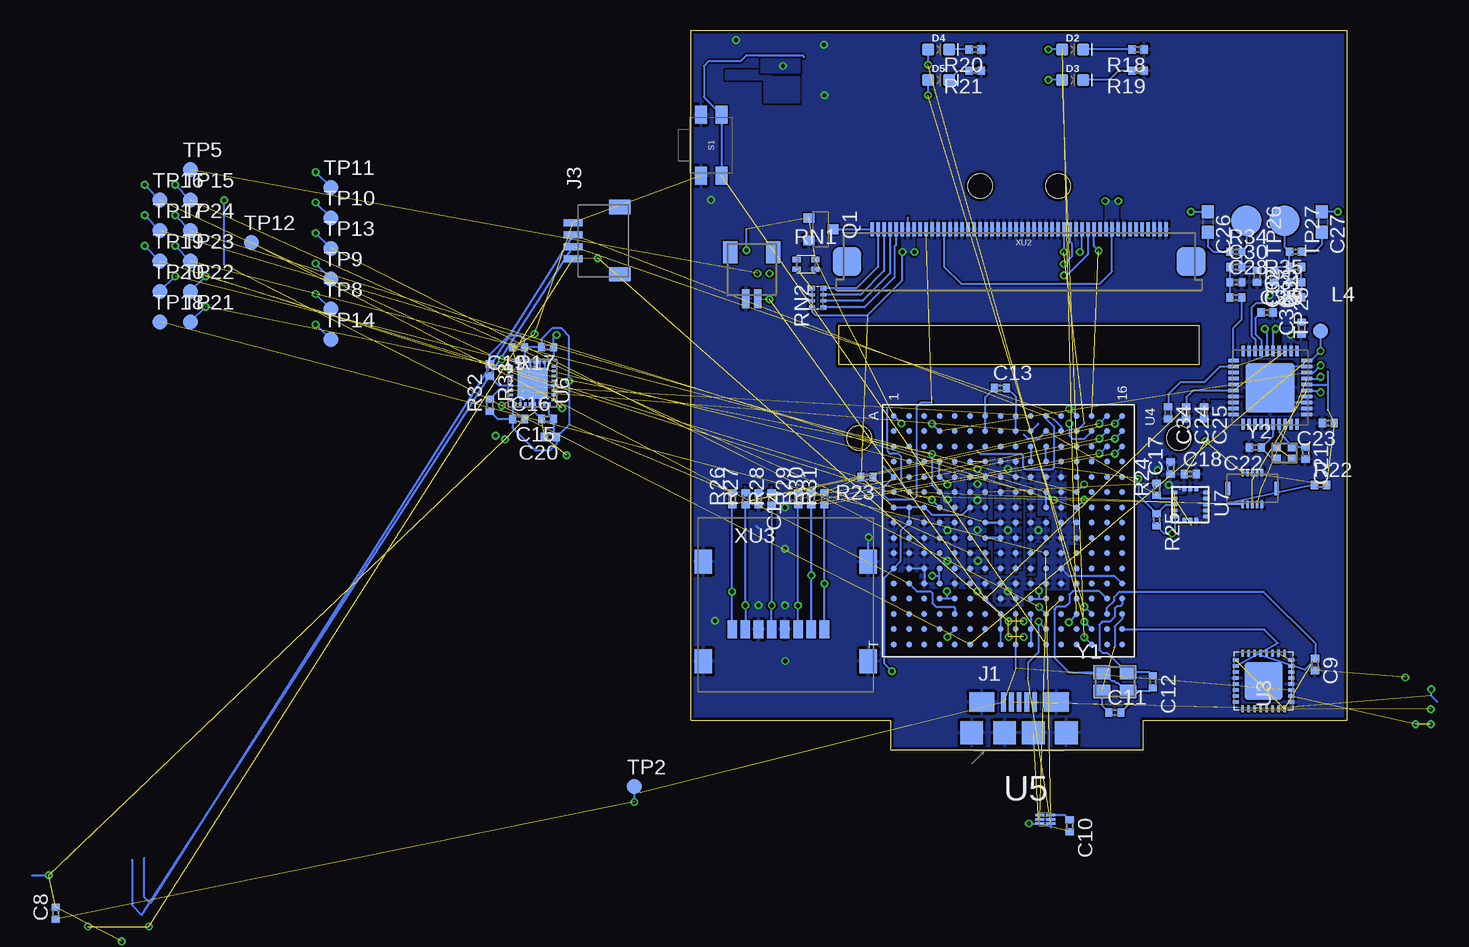
[diagram p8: board, bottom side, seen from below]

Size 54.66 x 60 mm. Coordinates in mm from the lower left corner, seen from the top.
Outline: 54.66,2.5 54.66,60 0,60 0,2.5 17,2.5 17,0 38,0 38,2.5 54.66,2.5
Outline: 12.35,35.4 12.35,32.1 42.35,32.1 42.35,35.4 12.35,35.4
Copper layers (1*2*15*16): Top 0.035mm / dielectric 0.23mm / VCC 0.035mm / dielectric 0.2mm / Signal 0.035mm / dielectric 0.23mm / Bottom 0.035mm
Design rules "MF_4_mil_drill_4_Layer *": minimum track width 5mil, minimum drill 4mil, track to track 6mil, track to pad 0.21mm, pad to pad 5mil, via to via 6mil, smd to smd 0mil, copper to edge 10mil, drill to drill 10mil, minimum pad ring 6mil, minimum via ring 6mil, stop-mask expansion 2mil, vias tented up to drill 2mm, thermal gap 10mil
Holes 2 mm at 24.08,47 30.58,47 14,26 40.66,26

### Footprints (pad centres in the part's own frame; a part is rotated, then mirrored left to right if it is on the bottom)
C0402 = smd 0.6 x 0.7: 1 -0.5,0; 2 0.5,0
C0603 = smd 1.1 x 1: 1 -0.85,0; 2 0.85,0
LED-0603 = smd 1 x 1: A -0.877,0; C 0.877,0
MICRO-USB-AB-SMD = smd 0.4 x 1.6: 1 -1.3,4; 2 -0.65,4; 3 0,4; 4 0.65,4; 5 1.3,4 | smd 2.1 x 1.6: PAD1 -3.1,4; PAD2 3.1,4 | smd 1.9 x 1.9: PAD3 -3.95,1.45; PAD4 -1.2,1.45; PAD5 1.2,1.45; PAD6 3.95,1.45
SH_CONNECTOR = smd 0.6 x 1.55: 1 0.5,4.775; 2 -0.5,4.775 | smd 1.2 x 1.8: PAD1 1.8,0.9; PAD2 -1.8,0.9
SM04B-SRSS-TB = smd 0.6 x 1.6: 1 -1.5,3.9; 2 -0.5,3.9; 3 0.5,3.9; 4 1.5,3.9 | smd 1.2 x 1.8: PADA -2.8,0; PADB 2.8,0
SOT-23-3 = smd 0.8 x 0.9: B -0.95,-1; C 0,1; E 0.95,-1
R0402 = smd 0.6 x 0.7: 1 -0.5,0; 2 0.5,0
EXBV4V = smd 0.45 x 0.7: 1 -0.4,-0.775; 2 0.4,-0.775; 3 0.4,0.775; 4 -0.4,0.775
EXBN8V = smd 0.38 x 0.5: 1 -0.8,-0.475; 4 0.8,-0.475; 5 0.8,0.475; 8 -0.8,0.475 | smd 0.25 x 0.5: 2 -0.25,-0.475; 3 0.25,-0.475; 6 0.25,0.475; 7 -0.25,0.475
EVQ-PUK = smd 1.5 x 1: 1 2.55,0.85; 2 2.55,-0.85; 3 -2.55,0.85; 4 -2.55,-0.85
B1,27 = smd 1.27 x 1.27: TP 0,0
B2,54 = smd 2.54 x 2.54: TP 0,0
QFN32 = smd 0.6 x 0.3: 1 -2.3,1.75; 2 -2.3,1.25; 3 -2.3,0.75; 4 -2.3,0.25; 5 -2.3,-0.25; 6 -2.3,-0.75; 7 -2.3,-1.25; 8 -2.3,-1.75; 17 2.3,-1.75; 18 2.3,-1.25; 19 2.3,-0.75; 20 2.3,-0.25; 21 2.3,0.25; 22 2.3,0.75; 23 2.3,1.25; 24 2.3,1.75 | smd 0.3 x 0.6: 9 -1.75,-2.3; 10 -1.25,-2.3; 11 -0.75,-2.3; 12 -0.25,-2.3; 13 0.25,-2.3; 14 0.75,-2.3; 15 1.25,-2.3; 16 1.75,-2.3; 25 1.75,2.3; 26 1.25,2.3; 27 0.75,2.3; 28 0.25,2.3; 29 -0.25,2.3; 30 -0.75,2.3; 31 -1.25,2.3; 32 -1.75,2.3 | smd 3.2 x 3.2: EXP 0,0
OSD335X-BGA-256 = smd 0.5 x 0.5: A1 -9.525,-9.525; A2 -9.525,-8.255; A3 -9.525,-6.985; A4 -9.525,-5.715; A5 -9.525,-4.445; A6 -9.525,-3.175; A7 -9.525,-1.905; A8 -9.525,-0.635; A9 -9.525,0.635; A10 -9.525,1.905; A11 -9.525,3.175; A12 -9.525,4.445; A13 -9.525,5.715; A14 -9.525,6.985; A15 -9.525,8.255; A16 -9.525,9.525; B1 -8.255,-9.525; B2 -8.255,-8.255; B3 -8.255,-6.985; B4 -8.255,-5.715; B5 -8.255,-4.445; B6 -8.255,-3.175; B7 -8.255,-1.905; B8 -8.255,-0.635; B9 -8.255,0.635; B10 -8.255,1.905; B11 -8.255,3.175; B12 -8.255,4.445; B13 -8.255,5.715; B14 -8.255,6.985; B15 -8.255,8.255; B16 -8.255,9.525; C1 -6.985,-9.525; C2 -6.985,-8.255; C3 -6.985,-6.985; C4 -6.985,-5.715; C5 -6.985,-4.445; C6 -6.985,-3.175; C7 -6.985,-1.905; C8 -6.985,-0.635; C9 -6.985,0.635; C10 -6.985,1.905; C11 -6.985,3.175; C12 -6.985,4.445; C13 -6.985,5.715; C14 -6.985,6.985; C15 -6.985,8.255; C16 -6.985,9.525; D1 -5.715,-9.525; D2 -5.715,-8.255; D3 -5.715,-6.985; D4 -5.715,-5.715; D5 -5.715,-4.445; D6 -5.715,-3.175; D7 -5.715,-1.905; D8 -5.715,-0.635; D9 -5.715,0.635; D10 -5.715,1.905; D11 -5.715,3.175; D12 -5.715,4.445; D13 -5.715,5.715; D14 -5.715,6.985; D15 -5.715,8.255; D16 -5.715,9.525; E1 -4.445,-9.525; E2 -4.445,-8.255; E3 -4.445,-6.985; E4 -4.445,-5.715; E5 -4.445,-4.445; E6 -4.445,-3.175; E7 -4.445,-1.905; E8 -4.445,-0.635; E9 -4.445,0.635; E10 -4.445,1.905; E11 -4.445,3.175; E12 -4.445,4.445; E13 -4.445,5.715; E14 -4.445,6.985; E15 -4.445,8.255; E16 -4.445,9.525; F1 -3.175,-9.525; F2 -3.175,-8.255; F3 -3.175,-6.985; F4 -3.175,-5.715; F5 -3.175,-4.445; F6 -3.175,-3.175; F7 -3.175,-1.905; F8 -3.175,-0.635; F9 -3.175,0.635; F10 -3.175,1.905; F11 -3.175,3.175; F12 -3.175,4.445; F13 -3.175,5.715; F14 -3.175,6.985; F15 -3.175,8.255; F16 -3.175,9.525; G1 -1.905,-9.525; G2 -1.905,-8.255; G3 -1.905,-6.985; G4 -1.905,-5.715; G5 -1.905,-4.445; G6 -1.905,-3.175; G7 -1.905,-1.905; G8 -1.905,-0.635; G9 -1.905,0.635; G10 -1.905,1.905; G11 -1.905,3.175; G12 -1.905,4.445; G13 -1.905,5.715; G14 -1.905,6.985; G15 -1.905,8.255; G16 -1.905,9.525; H1 -0.635,-9.525; H2 -0.635,-8.255; H3 -0.635,-6.985; H4 -0.635,-5.715; H5 -0.635,-4.445; H6 -0.635,-3.175; H7 -0.635,-1.905; H8 -0.635,-0.635; H9 -0.635,0.635; H10 -0.635,1.905; H11 -0.635,3.175; H12 -0.635,4.445; H13 -0.635,5.715; H14 -0.635,6.985; H15 -0.635,8.255; H16 -0.635,9.525; J1 0.635,-9.525; J2 0.635,-8.255; J3 0.635,-6.985; J4 0.635,-5.715; J5 0.635,-4.445; J6 0.635,-3.175; J7 0.635,-1.905; J8 0.635,-0.635; J9 0.635,0.635; J10 0.635,1.905; J11 0.635,3.175; J12 0.635,4.445; J13 0.635,5.715; J14 0.635,6.985; J15 0.635,8.255; J16 0.635,9.525; K1 1.905,-9.525; K2 1.905,-8.255; K3 1.905,-6.985; K4 1.905,-5.715; K5 1.905,-4.445; K6 1.905,-3.175; K7 1.905,-1.905; K8 1.905,-0.635; K9 1.905,0.635; K10 1.905,1.905; K11 1.905,3.175; K12 1.905,4.445; K13 1.905,5.715; K14 1.905,6.985; K15 1.905,8.255; K16 1.905,9.525; L1 3.175,-9.525; L2 3.175,-8.255; L3 3.175,-6.985; L4 3.175,-5.715; L5 3.175,-4.445; L6 3.175,-3.175; L7 3.175,-1.905; L8 3.175,-0.635; L9 3.175,0.635; L10 3.175,1.905; L11 3.175,3.175; L12 3.175,4.445; L13 3.175,5.715; L14 3.175,6.985; L15 3.175,8.255; L16 3.175,9.525; M1 4.445,-9.525; M2 4.445,-8.255; M3 4.445,-6.985; M4 4.445,-5.715; M5 4.445,-4.445; M6 4.445,-3.175; M7 4.445,-1.905; M8 4.445,-0.635; M9 4.445,0.635; M10 4.445,1.905; M11 4.445,3.175; M12 4.445,4.445; M13 4.445,5.715; M14 4.445,6.985; M15 4.445,8.255; M16 4.445,9.525; N1 5.715,-9.525; N2 5.715,-8.255; N3 5.715,-6.985; N4 5.715,-5.715; N5 5.715,-4.445; N6 5.715,-3.175; N7 5.715,-1.905; N8 5.715,-0.635; N9 5.715,0.635; N10 5.715,1.905; N11 5.715,3.175; N12 5.715,4.445; N13 5.715,5.715; N14 5.715,6.985; N15 5.715,8.255; N16 5.715,9.525; P1 6.985,-9.525; P2 6.985,-8.255; P3 6.985,-6.985; P4 6.985,-5.715; P5 6.985,-4.445; P6 6.985,-3.175; P7 6.985,-1.905; P8 6.985,-0.635; P9 6.985,0.635; P10 6.985,1.905; P11 6.985,3.175; P12 6.985,4.445; P13 6.985,5.715; P14 6.985,6.985; P15 6.985,8.255; P16 6.985,9.525; R1 8.255,-9.525; R2 8.255,-8.255; R3 8.255,-6.985; R4 8.255,-5.715; R5 8.255,-4.445; R6 8.255,-3.175; R7 8.255,-1.905; R8 8.255,-0.635; R9 8.255,0.635; R10 8.255,1.905; R11 8.255,3.175; R12 8.255,4.445; R13 8.255,5.715; R14 8.255,6.985; R15 8.255,8.255; R16 8.255,9.525; T1 9.525,-9.525; T2 9.525,-8.255; T3 9.525,-6.985; T4 9.525,-5.715; T5 9.525,-4.445; T6 9.525,-3.175; T7 9.525,-1.905; T8 9.525,-0.635; T9 9.525,0.635; T10 9.525,1.905; T11 9.525,3.175; T12 9.525,4.445; T13 9.525,5.715; T14 9.525,6.985; T15 9.525,8.255; T16 9.525,9.525
SON35P100X100X40-6N = smd 0.762 x 0.203: 1 -0.457,0.356; 2 -0.457,0; 3 -0.457,-0.356; 4 0.457,-0.356; 5 0.457,0; 6 0.457,0.356
QFN32-4MM = smd 0.4 x 0.2: 1 -1.8,1.4; 2 -1.8,1; 3 -1.8,0.6; 4 -1.8,0.2; 5 -1.8,-0.2; 6 -1.8,-0.6; 7 -1.8,-1; 8 -1.8,-1.4; 17 1.8,-1.4; 18 1.8,-1; 19 1.8,-0.6; 20 1.8,-0.2; 21 1.8,0.2; 22 1.8,0.6; 23 1.8,1; 24 1.8,1.4 | smd 0.2 x 0.4: 9 -1.4,-1.8; 10 -1,-1.8; 11 -0.6,-1.8; 12 -0.2,-1.8; 13 0.2,-1.8; 14 0.6,-1.8; 15 1,-1.8; 16 1.4,-1.8; 25 1.4,1.8; 26 1,1.8; 27 0.6,1.8; 28 0.2,1.8; 29 -0.2,1.8; 30 -0.6,1.8; 31 -1,1.8; 32 -1.4,1.8 | smd 2.6 x 2.6: EXP 0,0
LGA-16 = smd 0.3 x 0.4: 1 1,1.3; 2 0.5,1.3; 3 0,1.3; 4 -0.5,1.3; 5 -1,1.3; 9 -1,-1.3; 10 -0.5,-1.3; 11 0,-1.3; 12 0.5,-1.3; 13 1,-1.3 | smd 0.4 x 0.3: 6 -1.3,0.5; 7 -1.3,0; 8 -1.3,-0.5; 14 1.3,-0.5; 15 1.3,0; 16 1.3,0.5
HVQFN40 = smd 0.9 x 0.29: 1 -3.05,2.25; 2 -3.05,1.75; 3 -3.05,1.25; 4 -3.05,0.75; 5 -3.05,0.25; 6 -3.05,-0.25; 7 -3.05,-0.75; 8 -3.05,-1.25; 9 -3.05,-1.75; 10 -3.05,-2.25; 21 3.05,-2.25; 22 3.05,-1.75; 23 3.05,-1.25; 24 3.05,-0.75; 25 3.05,-0.25; 26 3.05,0.25; 27 3.05,0.75; 28 3.05,1.25; 29 3.05,1.75; 30 3.05,2.25 | smd 0.29 x 0.9: 11 -2.25,-3.05; 12 -1.75,-3.05; 13 -1.25,-3.05; 14 -0.75,-3.05; 15 -0.25,-3.05; 16 0.25,-3.05; 17 0.75,-3.05; 18 1.25,-3.05; 19 1.75,-3.05; 20 2.25,-3.05; 31 2.25,3.05; 32 1.75,3.05; 33 1.25,3.05; 34 0.75,3.05; 35 0.25,3.05; 36 -0.25,3.05; 37 -0.75,3.05; 38 -1.25,3.05; 39 -1.75,3.05; 40 -2.25,3.05 | smd 4.1 x 4.1: EXP 0,0
DF37NB-10DS-0.4V = smd 0.23 x 0.63: 1 -0.8,-1.325; 2 -0.4,-1.325; 3 0,-1.325; 4 0.4,-1.325; 5 0.8,-1.325; 6 0.8,1.325; 7 0.4,1.325; 8 0,1.325; 9 -0.4,1.325; 10 -0.8,1.325 | smd 0.38 x 1.1: PADA 2.04,0; PADB -2.04,0
FPC/FFC_50PIN_0.5MMPITCH = smd 0.3 x 1.2: 1 -12.25,40.9; 2 -11.75,40.9; 3 -11.25,40.9; 4 -10.75,40.9; 5 -10.25,40.9; 6 -9.75,40.9; 7 -9.25,40.9; 8 -8.75,40.9; 9 -8.25,40.9; 10 -7.75,40.9; 11 -7.25,40.9; 12 -6.75,40.9; 13 -6.25,40.9; 14 -5.75,40.9; 15 -5.25,40.9; 16 -4.75,40.9; 17 -4.25,40.9; 18 -3.75,40.9; 19 -3.25,40.9; 20 -2.75,40.9; 21 -2.25,40.9; 22 -1.75,40.9; 23 -1.25,40.9; 24 -0.75,40.9; 25 -0.25,40.9; 26 0.25,40.9; 27 0.75,40.9; 28 1.25,40.9; 29 1.75,40.9; 30 2.25,40.9; 31 2.75,40.9; 32 3.25,40.9; 33 3.75,40.9; 34 4.25,40.9; 35 4.75,40.9; 36 5.25,40.9; 37 5.75,40.9; 38 6.25,40.9; 39 6.75,40.9; 40 7.25,40.9; 41 7.75,40.9; 42 8.25,40.9; 43 8.75,40.9; 44 9.25,40.9; 45 9.75,40.9; 46 10.25,40.9; 47 10.75,40.9; 48 11.25,40.9; 49 11.75,40.9; 50 12.25,40.9 | smd 2.4 x 2.4: PADA -14.35,38.2; PADB 14.35,38.2
HINGED_LID_MICROSD = smd 0.8 x 1.5: 1 3.225,-1.5; 2 2.125,-1.5; 3 1.025,-1.5; 4 -0.075,-1.5; 5 -1.175,-1.5; 6 -2.275,-1.5; 7 -3.375,-1.5; 8 -4.475,-1.5 | smd 1.45 x 2: G1 6.875,-4.15; G2 6.875,4.15; G3 -6.875,4.15; G4 -6.875,-4.15
4-SMD = smd 1.4 x 1.15: 1 -1.1,-0.8; 2 1.1,-0.8; 3 1.1,0.8; 4 -1.1,0.8
XRCGB = smd 0.75 x 0.7: 1 -0.675,-0.5; 2 0.675,-0.5; 3 0.675,0.5; 4 -0.675,0.5

### Placement (x,y rotation side)
C8  107.64,-13.6 90 bottom  (outside the outline)
C9  2.66,7.13 270 bottom
C10  23.11,-6.32 270 bottom  (outside the outline)
C11  19.34,3.14 0 bottom
C12  16.18,5.68 270 bottom
C13  28.88,30.18 0 bottom
C14  49.05,20.95 270 bottom
C15  66.64,27.6 180 bottom  (outside the outline)
C16  69.06,27.6 0 bottom  (outside the outline)
C17  14.71,23.5 90 bottom
C18  13.06,22.99 0 bottom
C19  69.06,33.56 180 bottom  (outside the outline)
C20  66.4,26.07 180 bottom  (outside the outline)
C21  3.45,24.75 270 bottom
C22  7.65,25.19 180 bottom
C23  1.55,27.25 180 bottom
C24  13.4,28.1 270 bottom
C25  11.9,28.1 270 bottom
C26  11.6,44 270 bottom
C27  2.08,44 270 bottom
C28  9.27,38.98 0 bottom
C29  4.29,38.98 180 bottom
C30  9.27,40.25 0 bottom
C31  4.29,40.25 180 bottom
C32  7.49,39.49 270 bottom
C33  6.07,39.49 270 bottom
C34  14.9,28.1 270 bottom
C35  6.65,36.46 0 bottom
C36  3.79,35.15 90 bottom
D2  22.86,58.38 0 bottom
D3  22.86,55.84 0 bottom
D4  34.04,58.38 0 bottom
D5  34.04,55.84 0 bottom
J1  27.33,0 0 bottom
J2  49.61,42.38 180 bottom
J3  60.6,42.45 90 bottom  (outside the outline)
L3  9.27,37.71 180 bottom
L4  4.29,37.71 0 bottom
Q1  43.85,43.4 270 bottom
R17  66.64,33.56 180 bottom  (outside the outline)
R18  17.4,58.38 180 bottom
R19  17.4,56.6 180 bottom
R20  30.99,58.38 180 bottom
R21  30.99,56.6 180 bottom
R22  2.2,22.1 0 bottom
R23  40,22.75 180 bottom
R24  15.85,21.72 90 bottom
R25  15.85,19.18 270 bottom
R26  51.25,20.95 90 bottom
R27  50.12,20.95 90 bottom
R28  47.95,20.95 90 bottom
R29  45.75,20.95 90 bottom
R30  44.65,20.95 90 bottom
R31  43.55,20.95 90 bottom
R32  71.45,28.74 90 bottom  (outside the outline)
R33  71.45,31.66 270 bottom  (outside the outline)
R34  9.27,41.52 0 bottom
R35  4.29,41.52 180 bottom
RN1  45.08,40.46 270 bottom
RN2  44.11,37.68 270 bottom
S1  53,50.4 270 bottom
TP2  59.41,-3.06 0 bottom  (outside the outline)
TP5  96.41,48.37 0 bottom  (outside the outline)
TP8  84.69,36.73 0 bottom  (outside the outline)
TP9  84.69,39.27 0 bottom  (outside the outline)
TP10  84.69,44.35 0 bottom  (outside the outline)
TP11  84.69,46.89 0 bottom  (outside the outline)
TP12  91.33,42.29 0 bottom  (outside the outline)
TP13  84.69,41.81 0 bottom  (outside the outline)
TP14  84.69,34.19 0 bottom  (outside the outline)
TP15  96.41,45.83 0 bottom  (outside the outline)
TP16  98.95,45.83 0 bottom  (outside the outline)
TP17  98.95,43.29 0 bottom  (outside the outline)
TP18  98.95,35.67 0 bottom  (outside the outline)
TP19  98.95,40.75 0 bottom  (outside the outline)
TP20  98.95,38.21 0 bottom  (outside the outline)
TP21  96.41,35.67 0 bottom  (outside the outline)
TP22  96.41,38.21 0 bottom  (outside the outline)
TP23  96.41,40.75 0 bottom  (outside the outline)
TP24  96.41,43.29 0 bottom  (outside the outline)
TP25  2.2,34.92 90 bottom
TP26  8.4,44.1 270 bottom
TP27  5.2,44.1 270 bottom
U3  6.95,5.75 0 bottom
U4  28.25,18.32 270 bottom
U5  25.15,-5.78 0 bottom  (outside the outline)
U6  67.9,30.57 90 bottom  (outside the outline)
U7  13.06,20.45 90 bottom
U8  6.4,30.2 180 bottom
XU1  7.89,21.8 0 bottom
XU2  27.33,2.5 0 bottom
XU3  46.77,11.54 0 bottom
Y1  19.34,5.68 0 bottom
Y2  5.23,24.75 0 bottom

### Tracks (layer width: path | path; a pad name or v marks a point on that pad's centre or on a via)
3V3  (via drill 0.35)  (13 unrouted)
  Bottom 0.15: U4.H2 37.2,18.26 37.2,15.72 U4.L1
  Bottom 0.152: C19.1 68.5,33.6 68.47,33.56 R17.2 67.14,34.23 66.24,35.14 65.49,35.14 64.85,34.5 v64.85,30.75 64.85,27.1 65.88,26.07 C20.1 | TP16.TP v100.22,47.1 | v37.93,6.56 38.56,7.19 38.56,14.36 U4.L1 | R25.2 15.21,18.04 v14.58,18.04 14.36,18.26 U7.5 | U6.1 69.56,28.51 C16.1 | C19.1 68.56,34.21 68.88,34.53 69.87,34.53 71.45,32.95 R33.1 | U6.22 68.5,33.51 C19.1 | R32.1 70.81,27.6 C16.1 | 36.51,20.12 U4.G2 U4.G1 | 36.51,20.12 U4.H2 | 36.51,20.12 36.4,20.23 U4.G3 34.6,19.59 32.05,19.59 U4.G6 | C20.1 66.14,26.32 C15.1 66.5,27.95 U6.8 | 46.85,21.45 | C16.1 69.56,26.86 67.65,24.95 66.46,24.95 65.9,25.51 C20.1 | XU2.13 33.58,40.28 32.15,38.85 20.6,38.85 19.58,39.87 XU2.41 | XU2.7 36.58,44.38 | 1.6,31.55 1.6,30.45 | U8.6 1.6,30.45 | RN2.1 RN2.2 RN2.3 RN2.4 44.59,36.53 44.3,36.25 39.95,36.25 37.06,39.14 v37.06,41.5 | RN1.2 RN1.1 | 1.6,30.45 1.6,28.35 | XU1.9 XU1.10
  other vias: 30.8,20.82 30.8,22.17 46.85,16.78 14.83,22.1 30.8,18.33 46.85,20.2 46.85,12.05 19.05,45.75 20.15,45.75 36.06,41.5 11.8,25.75
  pour Bottom: 31.45,17.03 31.45,22.17 30.15,22.17 30.15,17.03
  pour Bottom: 51.22,21.11 50.67,21.96 42.97,21.96 43.52,21.11
  pour VCC: 0.05,52.03 10.16,52.03 10.16,24.05 29.84,24.05 29.84,20.28 0.05,20.28
  pour Bottom: 13.44,23.35 13.44,21.36 16.28,21.36 16.28,23.35
  pour Bottom: 45.73,9.27 47.89,9.27 47.34,22.22 45.19,22.22
  pour VCC: 0.25,50.76 0.25,52.54 18.8,52.54 18.8,50.76
  pour VCC: 40.1,11.9 46.35,11.9 46.35,46.44 17.55,46.44 17.55,38.15 40.1,38.1
  pour Bottom: 19.05,43.35 19.05,45.75 20.15,45.75 20.15,43.35
  pour Bottom: 37.11,43.9 37.11,41.5 36.06,41.5 36.06,43.9
  pour VCC: 10.79,24.73 10.79,31.65 40.1,31.65 40.1,24.73
#RESET  (via drill 0.35)  (1 unrouted)
  Top 0.152: v25.7,10.7 31.42,13.02 23.05,13.02 22.61,13.45 13.2,13.45 9.07,17.57 7.24,17.57 | 7.24,17.57 5.53,17.57 2.65,20.45 2.65,40.36 v65.88,34.58 | v85.96,35.46 7.24,16.09 7.24,17.57
  Bottom 0.15: 24.69,-6.42 U5.4
  Bottom 0.152: U4.R11 v25.7,10.69 v25.7,10.7 25.7,8.14 26.58,7.26 26.58,6.03 | U6.17 66.14,32.73 R17.1 66.14,34.32 v65.88,34.58 | v85.96,35.46 TP14.TP | 24.69,-6.42 24.69,-6.47
AIN.VREF+
  Bottom 0.152: C13.1 30.16,29.4 U4.A7 U4.B7
AIN.VREF-
  Bottom 0.152: C13.2 27.61,29.42 U4.A9 U4.B9
ANT_1
  Bottom 0.152: TP26.TP 8.4,41.89 R34.2 C30.2 7.75,40.25 C32.1
ANT_2
  Bottom 0.152: C33.1 5.81,40.25 C31.2 R35.2 5.2,41.93 TP27.TP
D2_CAT
  Bottom 0.152: R18.2 D2.C
D3_CAT
  Bottom 0.152: R19.2 19.05,56.6 19.81,55.84 D3.C
D4_CAT
  Bottom 0.152: R20.2 D4.C
D5_CAT
  Bottom 0.152: R21.2 32.4,56.6 D5.C
EEPROM.WP  (1 unrouted)
  Bottom 0.15: 32.7,11.87 U4.P5 | U4.M2 36.15,13.52
  Bottom 0.152: 35.85,13.22 35.86,13.22 36.15,13.51 36.15,13.52 | 35.85,13.22 34.72,13.22 34.57,13.07 34.57,12.25 34.27,11.96 32.78,11.96 32.7,11.87 | 35.87,13.2 35.85,13.22
EMCF_ANTM1
  Bottom 0.152: C30.1 C28.1 L3.2
EMCF_ANTM2
  Bottom 0.152: C31.1 C29.1 L4.2
GND  (via drill 0.35)  (21 unrouted)
  Bottom 0.15: v26.5,-6.13 25.66,-6.13 U5.3 | 109.63,-10.44 v108.23,-10.44 | XU3.G2 v39.87,17.72 | U6.12 67.7,30.37 U6.EXP | U4.L2 U4.L3 U4.M3
  Bottom 0.152: 7.4,38.85 C32.2 | 6.1,38.85 C33.2 | U8.9 4.65,31.95 U8.EXP 5.15,28.95 U8.3 | U6.EXP 68.9,31.57 U6.23 U6.24 | U6.EXP 68.1,30.77 U6.21 U6.20 | U6.19 U6.18 66.9,31.57 67.3,31.17 | U6.19 U6.20 | 67.83,30.64 U6.EXP | U6.19 67.3,31.17 | 67.3,31.17 67.7,30.77 | U6.20 67.7,30.77 | 67.7,30.77 67.83,30.64 | U6.2 68.9,29.57 U6.EXP | 67.7,30.14 U6.5 67.7,28.15 C15.2 | 67.7,30.14 67.7,30.51 67.83,30.64 | U6.6 67.3,29.74 67.7,30.14 | 49.05,18.5 49.23,18.68 | U4.M16 19.35,14.5 23.16,14.5 U4.L12
  other vias: 28.25,23.42 30.8,23.42 30.8,13.22 28.25,13.22 33.3,15.77 33.3,18.32 33.3,20.87 49.05,12.07 52.67,10.77 46.82,7.42 65.05,24.57 67.73,34.66 70.45,28.7 70.45,32.55 65.42,28.49 43.54,54.57 43.59,58.78 -4.88,6.04 70.19,25.88 50.93,59.16 53,45.84 15.78,23.32 102.13,-15.95 6.45,37.9
  pour Bottom (rank 2): 33.3,13.22 28.9,13.22 28.9,12.57 27.55,12.57 27.55,13.77 23.75,13.77 23.75,17.67 22.5,17.67 22.5,18.97 23.75,18.97 23.75,22.77 27.55,22.77 27.55,24.07 28.9,24.07 28.9,23.42 33.3,23.42 33.3,18.97 34,18.97 34,17.62 33.3,17.62
  pour Bottom (rank 6): 0,60 0,0 54.65,0 54.65,60
  pour Top (rank 6): 0,59.65 54.5,59.65 54.5,0 0,0
  pour Signal: 0,60 0,2.5 54.66,2.5 54.66,60
  cutout Bottom: 6.18,25.6 6.18,24.65 4.23,24.65 4.23,25.6
I2C0_SCL
  Bottom 0.152: U4.C10 U4.D10
I2C0_SDA
  Bottom 0.152: U4.D11 U4.C11
I2C1_SCL  (via drill 0.35)  (4 unrouted)
  VCC 0.152: v70.96,26.19 7.11,21.93 10.37,18.67 12.93,18.67
  Bottom 0.152: 26.96,26.31 26.57,25.92 25.73,25.92 U4.B11 | U8.7 2.35,30.95 v2.2,31.1 | U7.2 15.58,20.95 R24.1
I2C1_SDA  (via drill 0.35)  (3 unrouted)
  VCC 0.152: 12.05,19.55 10.89,19.55 7.9,22.54 v17.4,22.6
  Bottom 0.152: U4.A11 25.07,27.61 24.41,26.95 24.41,23.55 24.59,23.36 26.75,23.36 26.99,23.6 26.99,24.48 27.17,24.66 30.57,24.66 30.77,24.86 | U8.5 2.35,29.95 v2.2,29.8 | U7.3 15.08,20.45 R25.1 17.4,21.23 v17.4,22.6
KILL
  pour Bottom: 45.65,56.05 48.6,56.05 48.6,54 45.65,54
  pour Bottom (rank 2): 48,55.9 48,56.6 51.8,56.6 51.8,55.9
LCD_CLK  (via drill 0.35)
  Signal 0.152: v22.25,41.5 21.4,40.65 14.17,40.65 9.93,36.41 9.93,31.95 11.79,30.1 14.94,30.1 18.23,26.81 v23.15,28.42
  Bottom 0.152: v22.25,41.5 22.08,41.67 XU2.36 | U4.A13 23.11,28.42 v23.15,28.42
LCD_CS  (via drill 0.35)  (1 unrouted)
  Bottom 0.152: v20.7,41.6 21.08,41.98 XU2.38
LCD_D/C  (via drill 0.35)
  Top 0.152: v33.3,9.42 36.13,24.05 10.7,24.05 9.95,24.8 9.95,36.35 13.15,39.55 v23.6,39.55
  Bottom 0.152: U4.R5 33.3,9.46 v33.3,9.42 | XU2.37 21.58,41.31 23.34,39.55 v23.6,39.55
LCD_MISO  (via drill 0.35)  (1 unrouted)
  Bottom 0.152: v23.6,41.5 23.58,41.52 XU2.33 | 21.9,27.21 U4.B13
LCD_MOSI  (via drill 0.35)
  Signal 0.152: v23.6,40.5 23.35,40.25 14.21,40.25 10.24,36.28 10.24,32.08 11.91,30.4 15.06,30.4 18.77,26.7 18.77,25.16 19.45,24.48 v23.15,27.2
  Bottom 0.152: XU2.34 23.08,42.35 22.94,42.21 22.94,41.16 v23.6,40.5 | U4.B14 21.91,25.93 22.88,25.93 23.15,26.2 v23.15,27.2
LCD_RESET  (3 unrouted)
  Bottom 0.152: 34.6,28.93 35.54,28.93 35.9,28.56 35.9,21.1 36.15,20.85 38.21,20.85 38.61,21.25 38.61,21.93 U4.E1 38.65,23.64
LEDA@2
  Bottom 0.152: XU2.2 39.08,40.27 40.87,38.48 RN2.8
LEDA@3
  Bottom 0.152: XU2.3 38.58,39.92 40.57,37.93 RN2.7
LEDA@4
  Bottom 0.152: XU2.4 38.08,39.72 40.37,37.43 RN2.6
LEDA@5
  Bottom 0.152: RN2.5 40.22,36.88 37.72,39.38 37.72,41.96 37.58,42.1 XU2.5
LEDK
  Bottom 0.152: Q1.C XU2.1
LITE  (via drill 0.35)  (3 unrouted)
  Bottom 0.152: U4.A1 v37.14,27.21 | v50.05,41.64 50.05,43.41
MMC0.CLK  (via drill 0.35)  (1 unrouted)
  Bottom 0.152: U4.B15 20.62,25.95 v20.65,25.95 | R28.1 v47.95,12.05 XU3.5
MMC0.CMD  (via drill 0.35)  (1 unrouted)
  Bottom 0.152: U4.B16 v19.35,25.95 | XU3.3 v45.75,12.05 R29.1
MMC0.D0  (via drill 0.35)  (1 unrouted)
  Bottom 0.152: U4.A16 18.73,27.82 v19.35,27.2 | R27.1 50.15,20.66 v50.15,12.05 XU3.7
MMC0.D1  (via drill 0.35)  (1 unrouted)
  Bottom 0.152: U4.A15 v20.64,27.2 v20.65,27.2 | XU3.8 v51.25,13.2 R26.1
MMC0.D2  (via drill 0.35)  (1 unrouted)
  Bottom 0.152: U4.C16 19.33,24.7 v19.35,24.7 | XU3.1 v43.55,13.86 R31.1
MMC0.D3  (via drill 0.35)  (1 unrouted)
  Bottom 0.152: U4.C15 20.6,24.7 v20.65,24.7 | XU3.2 v44.65,14.55 R30.1
N$1  (1 unrouted)
NC  (1 unrouted)
NO_GND
  cutout Bottom: 38.55,14.7 38.55,7.85 17.55,7.85 17.55,28.75 38.6,28.75 38.6,19.7 33.95,19.7 33.95,23.4 30.1,23.4 30.1,24.6 27.2,24.6 27.2,23.4 23.3,23.4 23.3,19.5 22.2,19.5 22.2,17 23.1,17 23.1,13.2 26.9,13.2 26.9,11.85 29.6,11.85 29.6,13.3 35.7,13.3 35.7,14.7
OSC_GND
  Bottom 0.152: Y1.2 18.38,4.88 19.1,5.6 19.25,5.6 19.4,5.75 19.6,5.75 20.33,6.48 Y1.4 23.18,6.48 24.4,7.7 24.4,11.75 24.2,11.95 23.45,11.95 23.15,12.25 23.15,12.95 22.85,13.25 20.64,13.25 U4.N15 | Y1.2 16.48,4.88 C12.2 | C11.2 18.25,3.73 Y1.2
PMIC1  (via drill 0.35)
  VCC 0.152: v85.96,38 9.39,9.62 25.46,9.62 v25.69,13.27
  Bottom 0.152: U4.N10 25.69,12.61 | 25.69,12.61 U4.N11 | v25.69,13.27 25.69,12.61 | TP8.TP v85.96,38
PMIC2  (via drill 0.35)
  VCC 0.152: v85.96,40.54 11.63,9.92 25.34,9.92 32.83,17.41 32.83,24.6 v33.33,13.24
  Bottom 0.15: U4.N5 33.33,12.61 U4.N4
  Bottom 0.152: v33.33,13.24 33.33,12.61 | v85.96,40.54 TP9.TP
PMIC3  (via drill 0.35)
  VCC 0.152: v34.58,14.51 32.14,17.15 25.21,10.23 14.65,10.23 3.81,21.07 v85.96,45.62
  Bottom 0.15: U4.M4 33.97,14.51 U4.L4
  Bottom 0.152: v34.58,14.51 33.97,14.51 | TP10.TP v85.96,45.62
PMIC4  (via drill 0.35)
  VCC 0.152: v33.31,22.13 25.18,24.5 29.78,24.5 31.5,22.78 31.5,17.33 24.7,10.53 16.89,10.53 3.81,23.61 v85.96,48.16
  Bottom 0.15: U4.E4 U4.D4
  Bottom 0.152: U4.E4 33.94,22.77 v33.31,22.13 | v85.96,48.16 TP11.TP
PMIC_PB  (1 unrouted)
  Bottom 0.152: S1.1 S1.3 53.6,54.4 53.6,57 53.2,57.4 50.55,57.4 50.05,57.9 45.4,57.9 45.25,57.75
PMIC_PGOOD  (via drill 0.35)  (3 unrouted)
  Bottom 0.152: U4.P11 v25.66,11.92 | TP13.TP v85.96,43.08
RFID_IRQ  (via drill 0.35)  (1 unrouted)
  Bottom 0.152: v34.6,27.2 U4.B4 | U8.8 2.8,31.45 v2.2,32.05
RFID_MISC_1
  Bottom 0.152: C26.2 11.6,42 11.12,41.52 R34.1
RFID_MISC_2
  Bottom 0.152: C27.2 2.08,42.12 2.68,41.52 R35.1
RFID_OSC_IN
  Bottom 0.152: Y2.1 6.2,24.25 C22.1 6.15,26.19 U8.36
RFID_OSC_OUT
  Bottom 0.152: C21.1 Y2.3 5.5,26.35 5.65,26.5 U8.37
RFID_RXN  (via drill 0.35)
  Signal 0.152: v0.75,44.85 4.35,44.85 5.89,43.31 5.89,35.16 v5.95,35.1
  Bottom 0.152: U8.15 6.15,34.9 v5.95,35.1 | v0.75,44.85 C27.1
RFID_RXP  (via drill 0.35)
  Signal 0.152: v6.85,35.1 7.01,35.26 7.01,43.3 8.56,44.85 v13,44.85
  Bottom 0.152: U8.16 6.65,34.9 v6.85,35.1 | v13,44.85 C26.1
RFID_TX1
  Bottom 0.152: U8.21 9.45,35.2 8.77,35.88 L3.1
RFID_TX2
  Bottom 0.152: L4.1 5.35,37.71 5.84,37.23 7.6,37.23 7.95,36.87 7.95,34.52 7.65,34.22 U8.18
RFID_VEN  (via drill 0.35)  (2 unrouted)
  Bottom 0.152: U8.10 3,32.45 v2.2,33.25 TP25.TP | v93.6,45.82 v93.6,45.81 93.6,40.45
RTC_1P8  (3 unrouted)
  Bottom 0.15: U5.6
  Bottom 0.152: C10.1 23.5,-5.42 U5.6
SIP_OSC_IN  (1 unrouted)
  Bottom 0.152: Y1.1 20.44,3.74 C11.1 | U4.P16 18.73,10.93 19.35,10.3 19.35,8.6
SIP_OSC_OUT
  Bottom 0.152: C12.1 16.48,6.48 Y1.3 18.33,6.48 19.95,8.1 20.4,8.1 20.65,8.35 20.65,10.45 20.4,10.7 19.75,10.7 19.35,11.1 19.35,11.8 19.15,12 18.9,12 18.73,12.18 U4.N16
SYS_VDD2_3P3V  (via drill 0.35)  (1 unrouted)
  Bottom 0.152: TP17.TP v100.22,44.56 | U4.F11 24.44,20.86 v24.44,20.83
  Bottom 0.2: U4.F11 U4.G11
SYS_VDD3_3P3V  (via drill 0.35)  (1 unrouted)
  Bottom 0.152: TP19.TP v100.22,42.02
  Bottom 0.2: U4.J7 U4.J8 | U4.H7 U4.H8
  other vias: 28.25,18.32
  pour Bottom: 29.3,14.77 27.2,14.77 27.2,21.82 29.3,21.82
SYS_VDD_1P8V  (via drill 0.35)  (1 unrouted)
  Bottom 0.152: TP20.TP v97.68,39.48
  other vias: 25.71,18.32
  pour Bottom: 26.6,14.62 26.6,21.87 26.05,21.87 26.05,19.27 24.9,19.27 24.9,17.37 26.05,17.37 26.05,14.62
SYS_VOUT  (via drill 0.35)  (1 unrouted)
  Bottom 0.152: TP15.TP v97.68,47.1
  other vias: 30.77,15.78
  pour Bottom: 31.55,14.82 29.9,14.82 29.9,16.62 31.55,16.62
TP_IRQ  (1 unrouted)
  Bottom 0.152: U4.F2 37.15,22.14 37.15,24.45 37.37,24.67 38.08,24.67 38.28,24.88 38.28,25.05 38.31,25.08 38.31,28.46 | XU1.1 10.28,20.48 R22.1
TPM_SCL  (1 unrouted)
  Bottom 0.152: R33.2 70.66,30.37 U6.29 | U4.A10 26.25,27.94
TPM_SDA  (1 unrouted)
  Bottom 0.152: 25.72,27.2 U4.B10 | R32.2 70.72,29.97 U6.30
UART0_RX  (1 unrouted)
  Bottom 0.152: J3.2 100.45,-13.75 101.27,-12.94 101.27,-9.15
UART0_TX  (1 unrouted)
  Bottom 0.152: U4.B12 23.8,26.93 24.43,27.55 | J3.3 99.78,-12.75 100.25,-12.28 100.25,-9
UART.RX_SIP.TX
  Bottom 0.152: U4.R16 6.92,10.07 5.75,8.9 U3.2
UART.TX_SIP.RX
  Bottom 0.152: U3.30 3.5,6.7 2.65,7.55 2.65,8.9 6.95,13.2 18.95,13.2 19.4,12.75 19.4,12.44 20,11.85 U4.P15
UART_3V3  (2 unrouted)
USB+  (via drill 0.35)  (2 unrouted)
  Bottom 0.152: v-7.03,5.05 -7.03,4.51 -7.52,4.02
USB-  (via drill 0.35)  (2 unrouted)
  Bottom 0.152: -7.02,3.37 v-6.99,3.4
USR0  (via drill 0.35)  (1 unrouted)
  Bottom 0.152: D2.A v24.89,58.38 | U4.P13 23.15,10.65 v23.17,10.65
USR1  (via drill 0.35)  (1 unrouted)
  Bottom 0.152: U4.T14 v21.9,9.41 | D3.A v24.89,55.84
USR2  (via drill 0.35)  (1 unrouted)
  Bottom 0.152: U4.R14 v21.9,10.68 | D4.A v34.91,57.11
USR3  (via drill 0.35)  (1 unrouted)
  Bottom 0.152: U4.P14 v21.9,11.95 | D5.A v34.91,54.57
VCC  (via drill 0.35)  (7 unrouted)
  other vias: 28.2,9.42 28.2,10.72 26.95,10.72 26.95,9.42 104.95,-14.71 99.87,-14.71 62.45,40.99
  pour Bottom: 28.2,8.72 26.95,8.72 26.95,11.37 28.2,11.37
  pour VCC: 38.1,20.9 38.1,11.39 51.8,11.39 51.8,3.77 1.6,3.77 1.6,8.5 33.66,8.5 33.66,20.9
VDD
  pour Bottom: 12.33,29.08 12.33,27.86 9.11,27.86 9.11,29.08
VDD(MID)
  Bottom 0.152: C35.1 7.65,35.96 7.65,34.65 7.15,34.15 U8.17
VDD(TX)  (1 unrouted)
  Bottom 0.152: U8.22 10.6,31.95 11.88,30.67 13.88,30.67 14.9,29.65 C34.1
VDD_CORE  (via drill 0.35)  (1 unrouted)
  Bottom 0.152: TP22.TP v95.14,39.48 | v34.6,20.86 U4.G4
VDD_MPU  (via drill 0.35)  (1 unrouted)
  Bottom 0.152: TP23.TP v97.68,42.02 | U4.F13 v21.9,22.13
VDDS_DDR  (via drill 0.35)  (1 unrouted)
  Bottom 0.152: v95.14,36.94 TP21.TP | v34.58,24.67 34.58,22.11 U4.F4
VDDS_PLL  (via drill 0.35)  (1 unrouted)
  Bottom 0.152: TP24.TP v97.68,44.56 | U4.G13 v21.9,20.86
VIN_AC
  Bottom 0.15: U4.P10 U4.R10 U4.T10
VIN_BAT  (via drill 0.35)  (5 unrouted)
  Bottom 0.15: U4.T8 U4.R8 U4.P8 U4.N7
  Bottom 0.152: C24.1 13.4,29.4 12.85,29.95 U8.26
  other vias: 48.13,39.71 48.13,37.55 49.15,39.71 4.7,34.6 47,57
  pour Bottom: 5.35,35.2 5.35,32.9 3.34,32.93 3.34,35.23
  pour Top: 44.32,7.33 44.32,13.29 48.31,13.29 48.31,10.83 45.95,10.83 45.95,7.33
  pour VCC: 47.24,11.9 51.82,11.9 51.82,59.52 32,59.52 32,47.2 47.24,47.2
  pour Bottom: 45.65,57.55 45.65,56.45 48.8,56.45 48.8,57.55
VIN_USB  (via drill 0.35)  (8 unrouted)
  Bottom 0.15: U3.18 U3.19
  Bottom 0.152: v59.41,-4.33 TP2.TP 58.91,-3.56 | 27.61,6.83 U4.T9
  other vias: -5.72,2.14 -6.99,2.14
  pour Top: 28.47,8.67 28.47,5.62 46.61,5.62 46.61,6.95 42.04,6.95 42.04,8.67

### Text on the board
tPlace: Cypher v1.0 / © 2018 Megahash Corp | www.megahash.us